# EAGLE design lpcCNC (EAGLE 8.3.1)

## Sheet 1 of 4
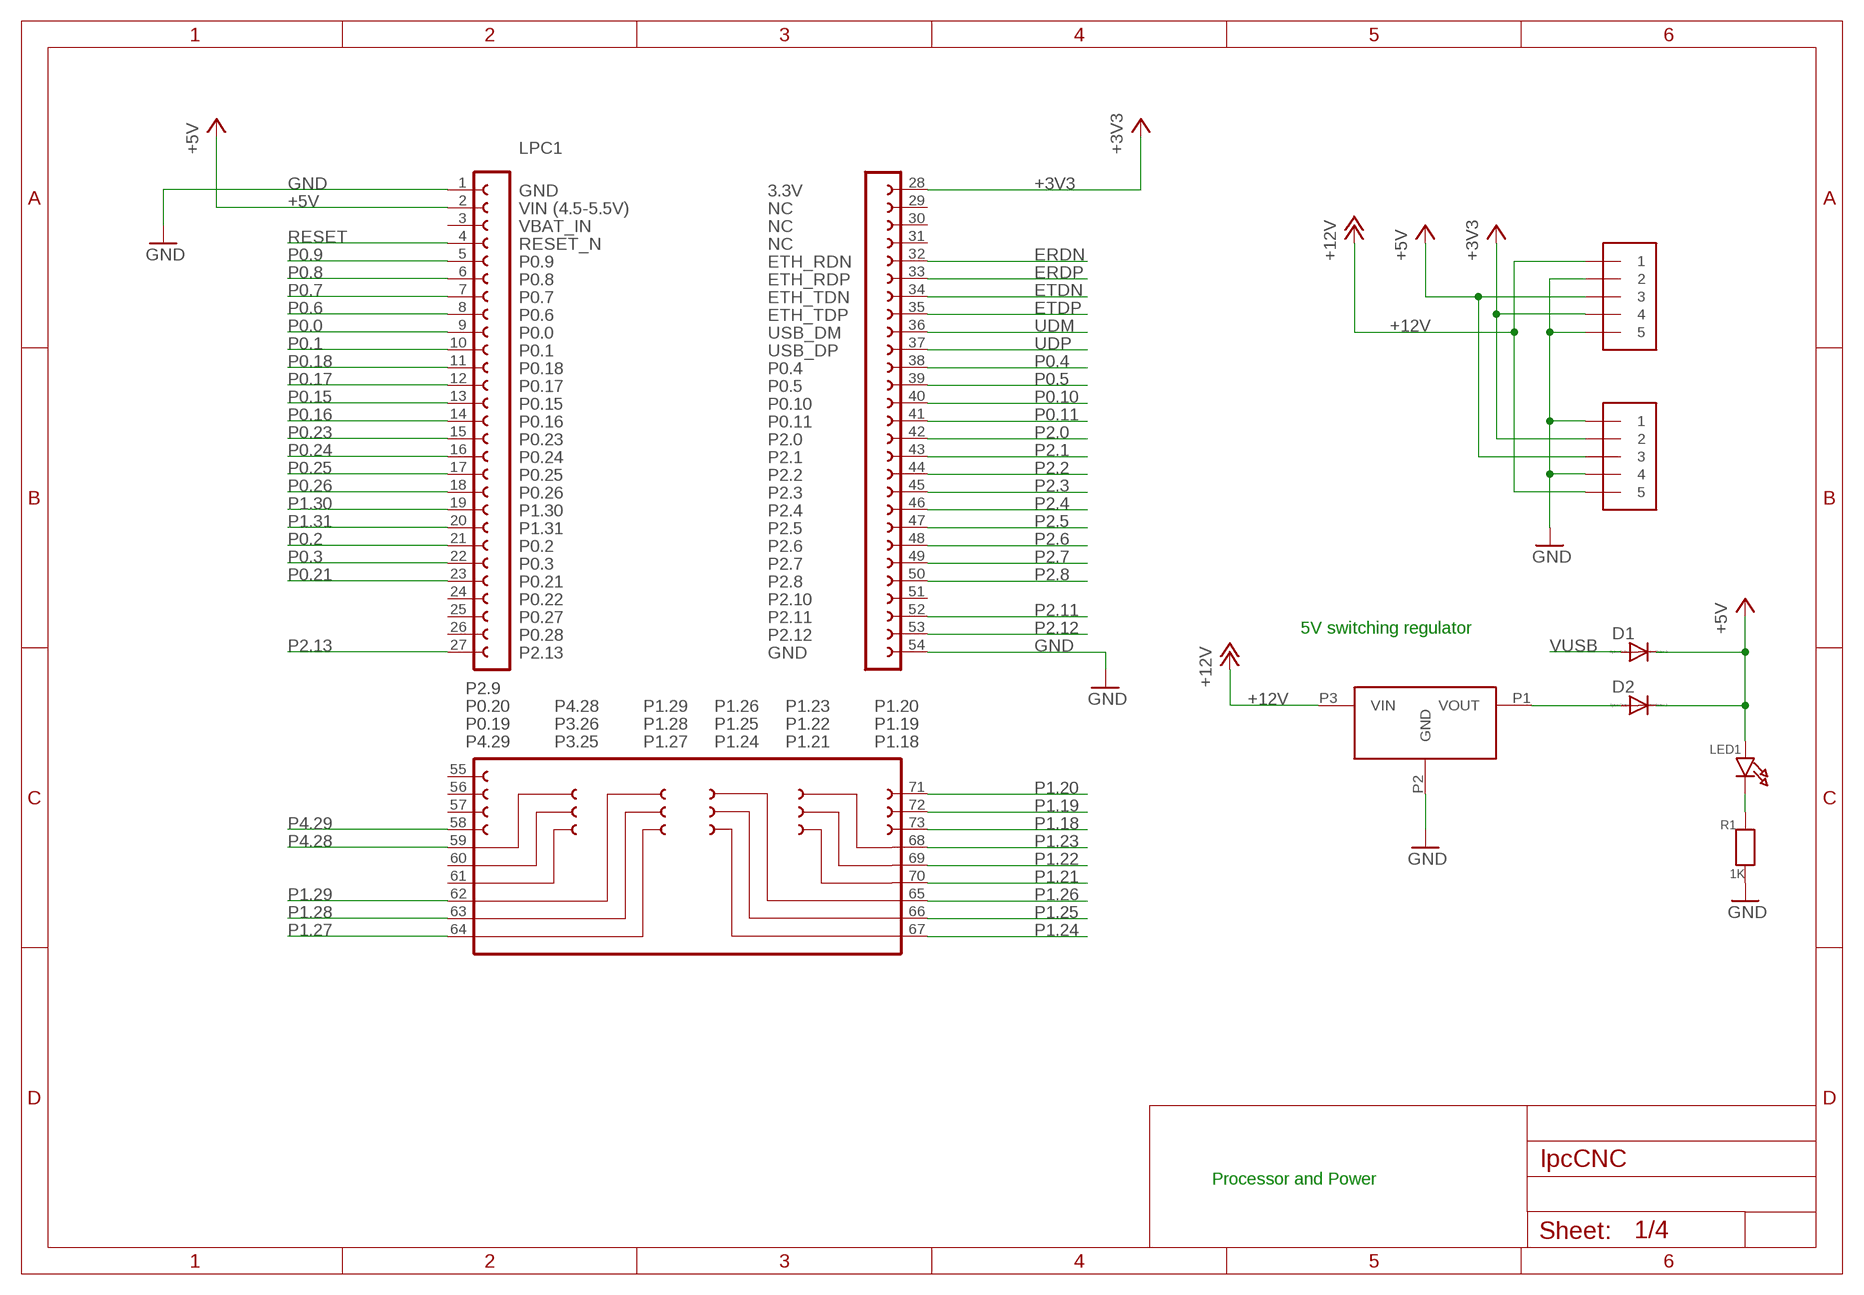
[diagram p0: schematic, sheet 1]

### Parts
D1  DIODE-DO-214AC  [DO-214AC]
D2  DIODE-DO-214AC  [DO-214AC]
J1  1X5  [1X05-3.5MM]
J2  1X5  [1X05-3.5MM]
LED1  LED0603  [CHIPLED_0603]
LPC1  LPCXPRESSO_LPC1769  [LPCXPRESSO_LPC1769]
R1  1K  RESISTOR0603  [0603]
VR1  78SR  [78SR]

### Nets
+3V3: J1.4 J2.2 LPC1.28 ; also sheet 2,3,4
+5V: D1.C D2.C J1.3 J2.3 LED1.A LPC1.2 ; also sheet 2,3,4
+12V: J1.1 J2.5 VR1.P3(VIN) ; also sheet 3
ERDN: LPC1.32 ; also sheet 2
ERDP: LPC1.33 ; also sheet 2
ETDN: LPC1.34 ; also sheet 2
ETDP: LPC1.35 ; also sheet 2
GND: J1.2 J1.5 J2.1 J2.4 LPC1.1 LPC1.54 R1.1 VR1.P2(GND) ; also sheet 2,3,4
N$1: D2.A VR1.P1(VOUT)
N$6: LED1.C R1.2
P0.0: LPC1.9 ; also sheet 4
P0.1: LPC1.10 ; also sheet 4
P0.2: LPC1.21 ; also sheet 2
P0.3: LPC1.22 ; also sheet 2
P0.4: LPC1.38 ; also sheet 3
P0.5: LPC1.39 ; also sheet 3
P0.6: LPC1.8 ; also sheet 2
P0.7: LPC1.7 ; also sheet 2
P0.8: LPC1.6 ; also sheet 2
P0.9: LPC1.5 ; also sheet 2
P0.10: LPC1.40 ; also sheet 3
P0.11: LPC1.41 ; also sheet 3
P0.15: LPC1.13 ; also sheet 2
P0.16: LPC1.14 ; also sheet 2
P0.17: LPC1.12 ; also sheet 2
P0.18: LPC1.11 ; also sheet 2
P0.21: LPC1.23 ; also sheet 4
P0.23: LPC1.15 ; also sheet 4
P0.24: LPC1.16 ; also sheet 4
P0.25: LPC1.17 ; also sheet 4
P0.26: LPC1.18 ; also sheet 4
P1.18: LPC1.73 ; also sheet 2
P1.19: LPC1.72 ; also sheet 2
P1.20: LPC1.71 ; also sheet 2
P1.21: LPC1.70 ; also sheet 2
P1.22: LPC1.69 ; also sheet 2
P1.23: LPC1.68 ; also sheet 3
P1.24: LPC1.67 ; also sheet 3
P1.25: LPC1.66 ; also sheet 3
P1.26: LPC1.65 ; also sheet 3
P1.27: LPC1.64 ; also sheet 2
P1.28: LPC1.63 ; also sheet 3
P1.29: LPC1.62 ; also sheet 3
P1.30: LPC1.19 ; also sheet 2
P1.31: LPC1.20 ; also sheet 3
P2.0: LPC1.42 ; also sheet 3
P2.1: LPC1.43 ; also sheet 3
P2.2: LPC1.44 ; also sheet 3
P2.3: LPC1.45 ; also sheet 3
P2.4: LPC1.46 ; also sheet 3
P2.5: LPC1.47 ; also sheet 3
P2.6: LPC1.48 ; also sheet 3
P2.7: LPC1.49 ; also sheet 3
P2.8: LPC1.50 ; also sheet 3
P2.11: LPC1.52 ; also sheet 3
P2.12: LPC1.53 ; also sheet 2
P2.13: LPC1.27 ; also sheet 3
P4.28: LPC1.59 ; also sheet 2
P4.29: LPC1.58 ; also sheet 2
RESET: LPC1.4 ; also sheet 2
UDM: LPC1.36 ; also sheet 2
UDP: LPC1.37 ; also sheet 2
VUSB: D1.A ; also sheet 2
Unconnected: LPC1.3 LPC1.24 LPC1.25 LPC1.26 LPC1.29 LPC1.30 LPC1.31 LPC1.51 LPC1.55 LPC1.56 LPC1.57 LPC1.60 LPC1.61

### Notes on the sheet
- 5V switching regulator
- Processor and Power

## Sheet 2 of 4
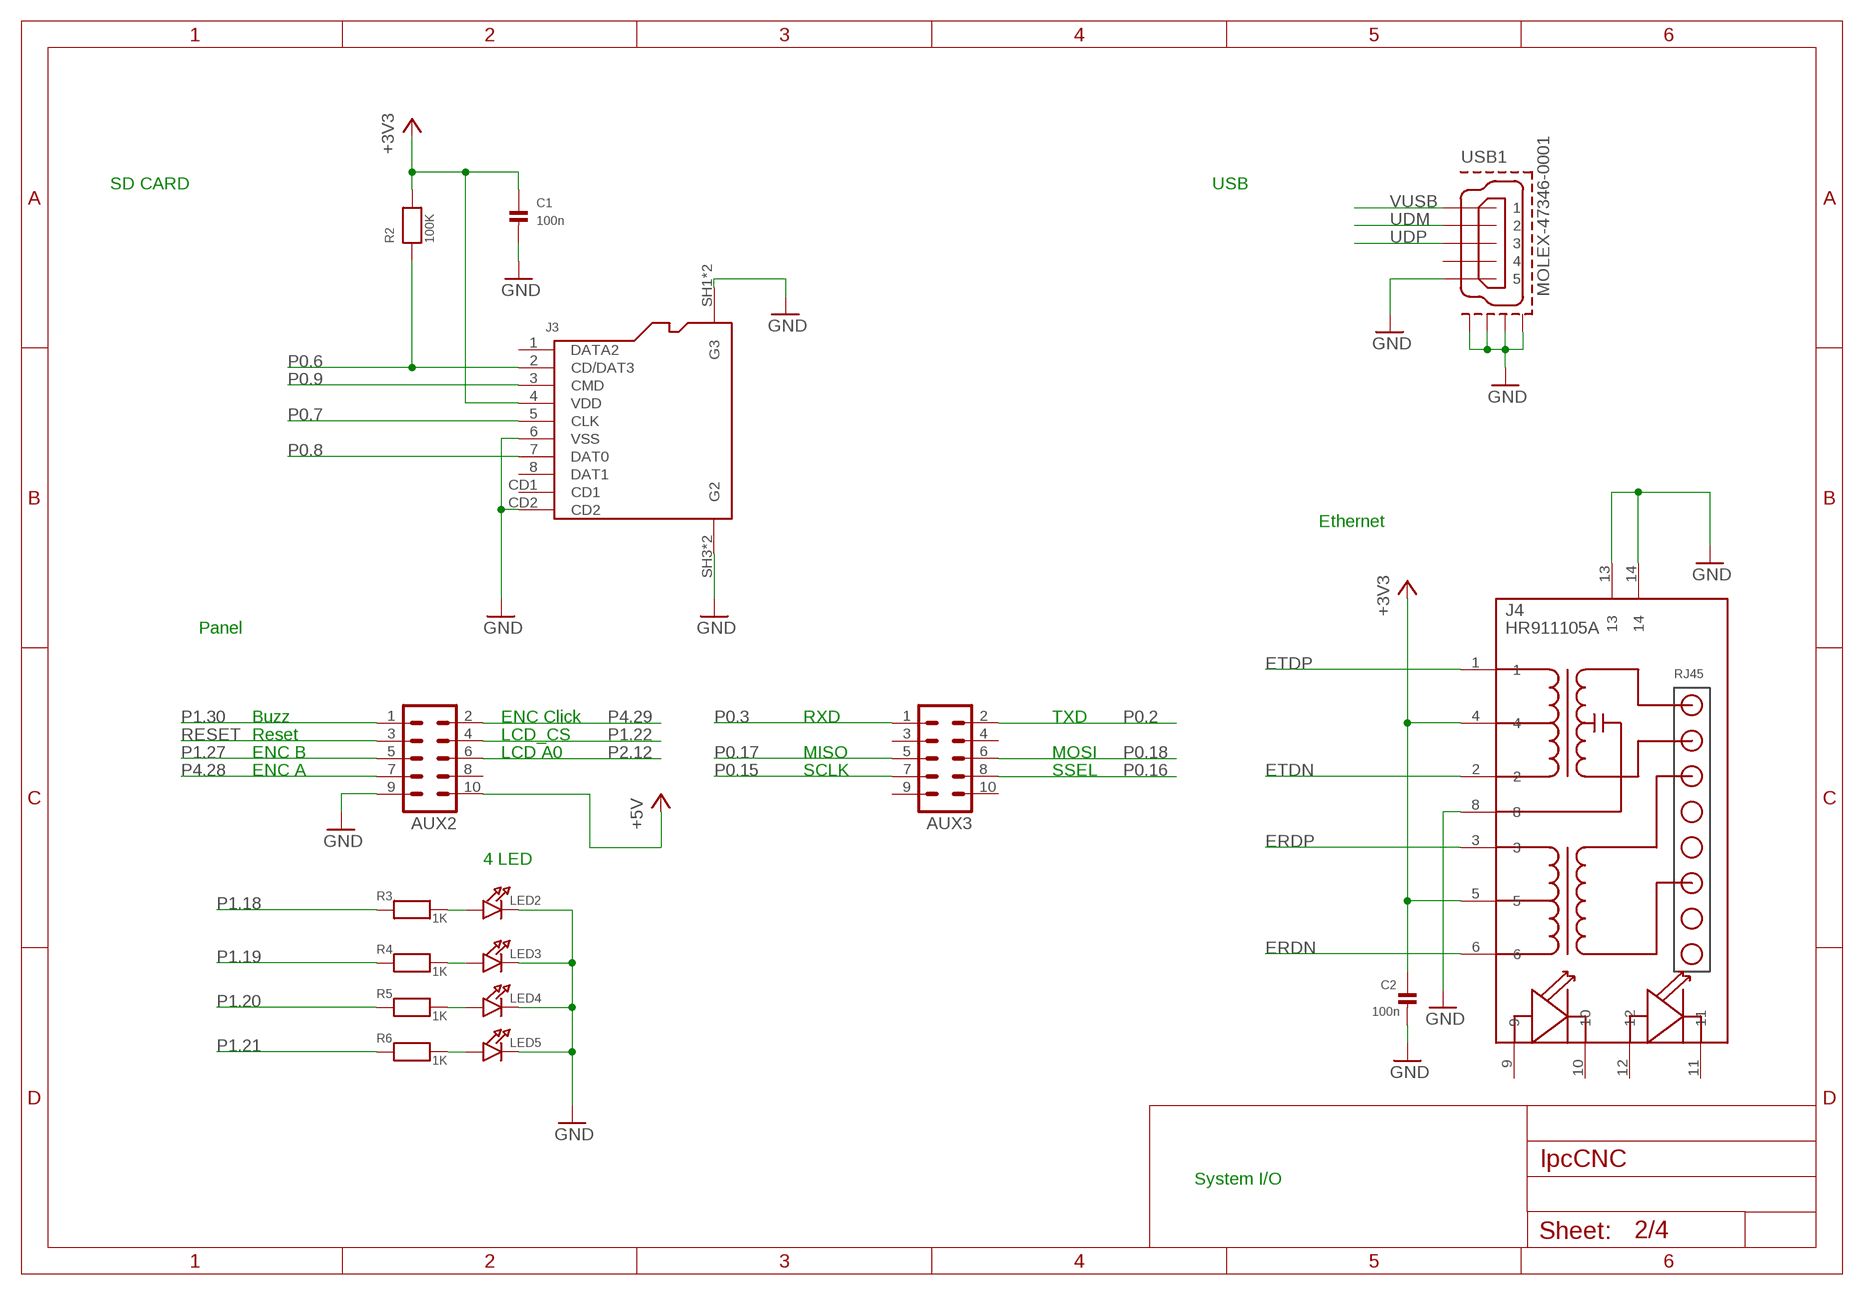
[diagram p1: schematic, sheet 2]

### Parts
AUX2  ML10  [ML10]
AUX3  ML10  [ML10]
C1  100n  CAP_CERAMIC0603  [0603]
C2  100n  CAP_CERAMIC0603  [0603]
J3  AMPHENOL_114-00841-68  [AMPHENOL_114-00841-68]
J4  HR911105A  [HR911105A]
LED2  LED0603  [CHIPLED_0603]
LED3  LED0603  [CHIPLED_0603]
LED4  LED0603  [CHIPLED_0603]
LED5  LED0603  [CHIPLED_0603]
R2  100K  RESISTOR0603  [0603]
R3  1K  RESISTOR0603  [0603]
R4  1K  RESISTOR0603  [0603]
R5  1K  RESISTOR0603  [0603]
R6  1K  RESISTOR0603  [0603]
USB1  MOLEX-47346-0001  [MOLEX-47364-0001]

### Nets
+3V3: C1.1 C2.1 J3.4(VDD) J4.4 J4.5 R2.2 ; also sheet 1,3,4
+5V: AUX2.10 ; also sheet 1,3,4
ERDN: J4.6 ; also sheet 1
ERDP: J4.3 ; also sheet 1
ETDN: J4.2 ; also sheet 1
ETDP: J4.1 ; also sheet 1
GND: AUX2.9 C1.2 C2.2 J3.6(VSS) J3.CD2 J3.SH1(G3) J3.SH2(G3) J3.SH3(G2) J3.SH4(G2) J4.8 J4.13 J4.14 LED2.C LED3.C LED4.C LED5.C USB1.5 USB1.GND1 USB1.GND2 USB1.GND3 USB1.GND4 ; also sheet 1,3,4
N$2: LED2.A R3.2
N$3: LED3.A R4.2
N$4: LED4.A R5.2
N$5: LED5.A R6.2
P0.2: AUX3.2 ; also sheet 1
P0.3: AUX3.1 ; also sheet 1
P0.6: J3.2(CD/DAT3) R2.1 ; also sheet 1
P0.7: J3.5(CLK) ; also sheet 1
P0.8: J3.7(DAT0) ; also sheet 1
P0.9: J3.3(CMD) ; also sheet 1
P0.15: AUX3.7 ; also sheet 1
P0.16: AUX3.8 ; also sheet 1
P0.17: AUX3.5 ; also sheet 1
P0.18: AUX3.6 ; also sheet 1
P1.18: R3.1 ; also sheet 1
P1.19: R4.1 ; also sheet 1
P1.20: R5.1 ; also sheet 1
P1.21: R6.1 ; also sheet 1
P1.22: AUX2.4 ; also sheet 1
P1.27: AUX2.5 ; also sheet 1
P1.30: AUX2.1 ; also sheet 1
P2.12: AUX2.6 ; also sheet 1
P4.28: AUX2.7 ; also sheet 1
P4.29: AUX2.2 ; also sheet 1
RESET: AUX2.3 ; also sheet 1
UDM: USB1.2 ; also sheet 1
UDP: USB1.3 ; also sheet 1
VUSB: USB1.1 ; also sheet 1
Unconnected: AUX2.8 AUX3.3 AUX3.4 AUX3.9 AUX3.10 J3.1(DATA2) J3.8(DAT1) J3.CD1 J4.9 J4.10 J4.11 J4.12 USB1.4

### Notes on the sheet
- SD CARD | USB
- Ethernet
- Panel
- Buzz | ENC Click | RXD | TXD
- Reset | LCD_CS
- ENC B | LCD A0 | MISO | MOSI
- ENC A | SCLK | SSEL
- 4 LED
- System I/O

## Sheet 3 of 4
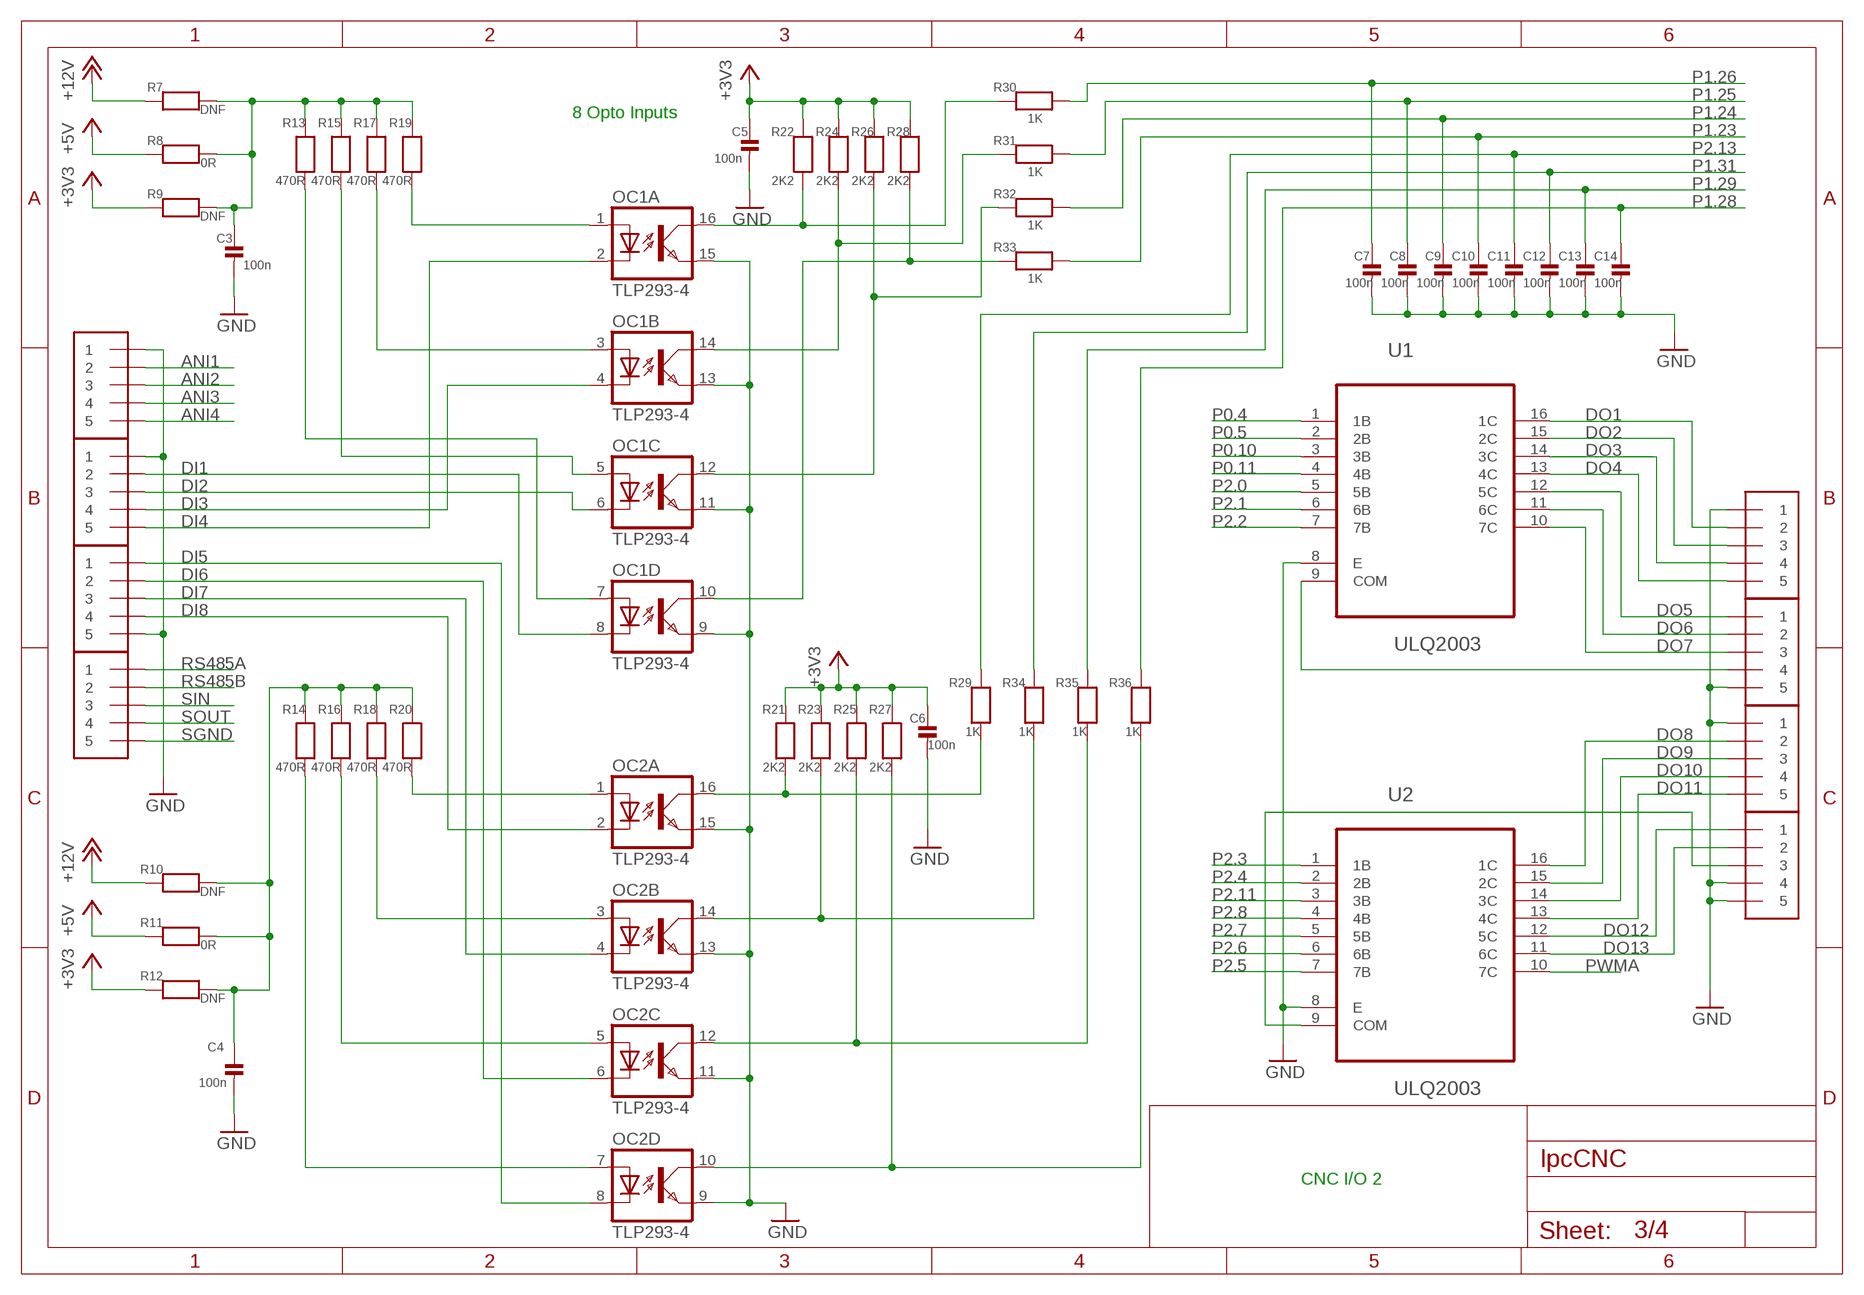
[diagram p2: schematic, sheet 3]

### Parts
C3  100n  CAP_CERAMIC0603  [0603]
C4  100n  CAP_CERAMIC0603  [0603]
C5  100n  CAP_CERAMIC0603  [0603]
C6  100n  CAP_CERAMIC0603  [0603]
C7  100n  CAP_CERAMIC0603  [0603]
C8  100n  CAP_CERAMIC0603  [0603]
C9  100n  CAP_CERAMIC0603  [0603]
C10  100n  CAP_CERAMIC0603  [0603]
C11  100n  CAP_CERAMIC0603  [0603]
C12  100n  CAP_CERAMIC0603  [0603]
C13  100n  CAP_CERAMIC0603  [0603]
C14  100n  CAP_CERAMIC0603  [0603]
J5  1X5  [1X05-3.5MM]
J6  1X5  [1X05-3.5MM]
J7  1X5  [1X05-3.5MM]
J8  1X5  [1X05-3.5MM]
J9  1X5  [1X05-3.5MM]
J10  1X5  [1X05-3.5MM]
J11  1X5  [1X05-3.5MM]
J12  1X5  [1X05-3.5MM]
OC1  TLP293-4  TLP283-4  [MINI-FLAT-16]
OC2  TLP293-4  TLP283-4  [MINI-FLAT-16]
R7  DNF  RESISTOR0603  [0603]
R8  0R  RESISTOR0603  [0603]
R9  DNF  RESISTOR0603  [0603]
R10  DNF  RESISTOR0603  [0603]
R11  0R  RESISTOR0603  [0603]
R12  DNF  RESISTOR0603  [0603]
R13  470R  RESISTOR0603  [0603]
R14  470R  RESISTOR0603  [0603]
R15  470R  RESISTOR0603  [0603]
R16  470R  RESISTOR0603  [0603]
R17  470R  RESISTOR0603  [0603]
R18  470R  RESISTOR0603  [0603]
R19  470R  RESISTOR0603  [0603]
R20  470R  RESISTOR0603  [0603]
R21  2K2  RESISTOR0603  [0603]
R22  2K2  RESISTOR0603  [0603]
R23  2K2  RESISTOR0603  [0603]
R24  2K2  RESISTOR0603  [0603]
R25  2K2  RESISTOR0603  [0603]
R26  2K2  RESISTOR0603  [0603]
R27  2K2  RESISTOR0603  [0603]
R28  2K2  RESISTOR0603  [0603]
R29  1K  RESISTOR0603  [0603]
R30  1K  RESISTOR0603  [0603]
R31  1K  RESISTOR0603  [0603]
R32  1K  RESISTOR0603  [0603]
R33  1K  RESISTOR0603  [0603]
R34  1K  RESISTOR0603  [0603]
R35  1K  RESISTOR0603  [0603]
R36  1K  RESISTOR0603  [0603]
U1  ULQ2003  ULN2003ADE4  [SOIC127P600X175-16N]
U2  ULQ2003  ULN2003ADE4  [SOIC127P600X175-16N]

### Nets
+3V3: C5.1 C6.1 R9.2 R12.2 R21.2 R22.2 R23.2 R24.2 R25.2 R26.2 R27.2 R28.2 ; also sheet 1,2,4
+5V: R8.2 R11.2 ; also sheet 1,2,4
+12V: R7.2 R10.2 ; also sheet 1
ANI1: J5.2 ; also sheet 4
ANI2: J5.3 ; also sheet 4
ANI3: J5.4 ; also sheet 4
ANI4: J5.5 ; also sheet 4
DI1: J6.2 OC1.8(D:C)
DI2: J6.3 OC1.6(C:C)
DI3: J6.4 OC1.4(B:C)
DI4: J6.5 OC1.2(A:C)
DI5: J7.1 OC2.8(D:C)
DI6: J7.2 OC2.6(C:C)
DI7: J7.3 OC2.4(B:C)
DI8: J7.4 OC2.2(A:C)
DO1: J9.2 U1.16(1C)
DO2: J9.3 U1.15(2C)
DO3: J9.4 U1.14(3C)
DO4: J9.5 U1.13(4C)
DO5: J10.1 U1.12(5C)
DO6: J10.2 U1.11(6C)
DO7: J10.3 U1.10(7C)
DO8: J11.2 U2.16(1C)
DO9: J11.3 U2.15(2C)
DO10: J11.4 U2.14(3C)
DO11: J11.5 U2.13(4C)
DO12: J12.1 U2.12(5C)
DO13: J12.2 U2.11(6C)
GND: C3.2 C4.2 C5.2 C6.2 C7.2 C8.2 C9.2 C10.2 C11.2 C12.2 C13.2 C14.2 J5.1 J6.1 J7.5 J9.1 J10.5 J11.1 J12.4 J12.5 OC1.9(D:EMIT) OC1.11(C:EMIT) OC1.13(B:EMIT) OC1.15(A:EMIT) OC2.9(D:EMIT) OC2.11(C:EMIT) OC2.13(B:EMIT) OC2.15(A:EMIT) U1.8(E) U2.8(E) ; also sheet 1,2,4
N$9: J10.4 U1.9(COM)
N$13: J12.3 U2.9(COM)
N$15: C3.1 R7.1 R8.1 R9.1 R13.2 R15.2 R17.2 R19.2
N$16: OC2.1(A:A) R20.1
N$31: OC2.3(B:A) R18.1
N$32: OC2.5(C:A) R16.1
N$33: OC2.7(D:A) R14.1
N$38: C4.1 R10.1 R11.1 R12.1 R14.2 R16.2 R18.2 R20.2
N$42: OC1.1(A:A) R19.1
N$43: OC1.3(B:A) R17.1
N$44: OC1.5(C:A) R15.1
N$49: OC1.7(D:A) R13.1
N$66: OC1.16(A:COL) R22.1 R30.2
N$67: OC1.14(B:COL) R24.1 R31.2
N$71: OC2.16(A:COL) R21.1 R29.1
N$72: OC2.14(B:COL) R23.1 R34.1
N$73: OC2.12(C:COL) R25.1 R35.1
N$74: OC2.10(D:COL) R27.1 R36.1
N$75: OC1.12(C:COL) R26.1 R32.2
N$89: OC1.10(D:COL) R28.1 R33.2
P0.4: U1.1(1B) ; also sheet 1
P0.5: U1.2(2B) ; also sheet 1
P0.10: U1.3(3B) ; also sheet 1
P0.11: U1.4(4B) ; also sheet 1
P1.23: C10.1 R33.1 ; also sheet 1
P1.24: C9.1 R32.1 ; also sheet 1
P1.25: C8.1 R31.1 ; also sheet 1
P1.26: C7.1 R30.1 ; also sheet 1
P1.28: C14.1 R36.2 ; also sheet 1
P1.29: C13.1 R35.2 ; also sheet 1
P1.31: C12.1 R34.2 ; also sheet 1
P2.0: U1.5(5B) ; also sheet 1
P2.1: U1.6(6B) ; also sheet 1
P2.2: U1.7(7B) ; also sheet 1
P2.3: U2.1(1B) ; also sheet 1
P2.4: U2.2(2B) ; also sheet 1
P2.5: U2.7(7B) ; also sheet 1
P2.6: U2.6(6B) ; also sheet 1
P2.7: U2.5(5B) ; also sheet 1
P2.8: U2.4(4B) ; also sheet 1
P2.11: U2.3(3B) ; also sheet 1
P2.13: C11.1 R29.2 ; also sheet 1
PWMA: U2.10(7C) ; also sheet 4
RS485A: J8.1 ; also sheet 4
RS485B: J8.2 ; also sheet 4
SGND: J8.5 ; also sheet 4
SIN: J8.3 ; also sheet 4
SOUT: J8.4 ; also sheet 4

### Notes on the sheet
- 8 Opto Inputs
- CNC I/O 2

## Sheet 4 of 4
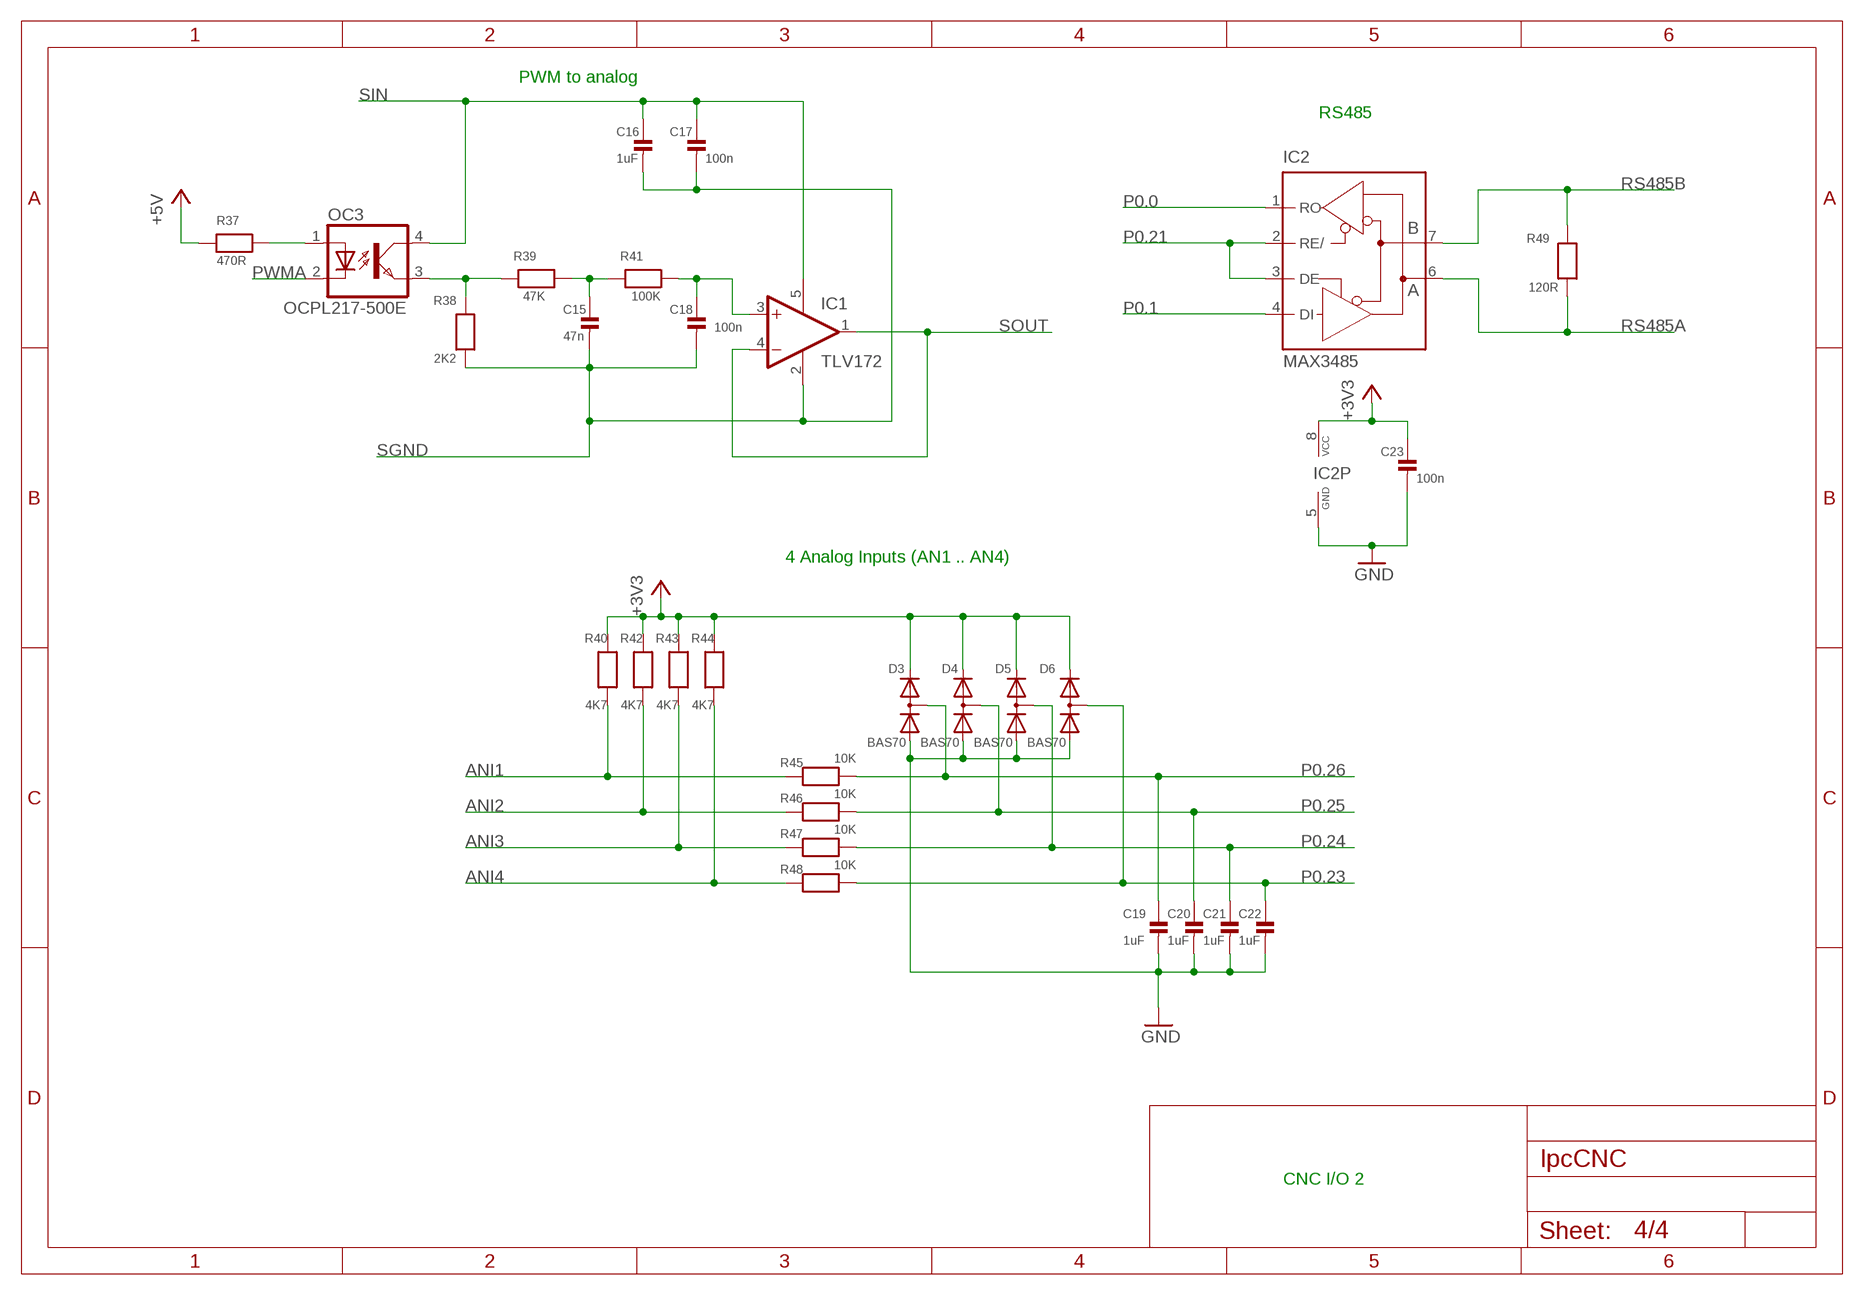
[diagram p3: schematic, sheet 4]

### Parts
C15  47n  CAP_CERAMIC0603  [0603]
C16  1uF  CAP_CERAMIC0603  [0603]
C17  100n  CAP_CERAMIC0603  [0603]
C18  100n  CAP_CERAMIC0603  [0603]
C19  1uF  CAP_CERAMIC0603  [0603]
C20  1uF  CAP_CERAMIC0603  [0603]
C21  1uF  CAP_CERAMIC0603  [0603]
C22  1uF  CAP_CERAMIC0603  [0603]
C23  100n  CAP_CERAMIC0603  [0603]
D3  BAS70  DIODE_2CACA-SOT23  [SOT23]
D4  BAS70  DIODE_2CACA-SOT23  [SOT23]
D5  BAS70  DIODE_2CACA-SOT23  [SOT23]
D6  BAS70  DIODE_2CACA-SOT23  [SOT23]
IC1  TLV172  TLV172MF  [SOT23-5]
IC2  MAX3485  MAX481CSA  [SO08]
OC3  OCPL217-500E  TLP283  [MINI-FLAT-4]
R37  470R  RESISTOR0603  [0603]
R38  2K2  RESISTOR0603  [0603]
R39  47K  RESISTOR0603  [0603]
R40  4K7  RESISTOR0603  [0603]
R41  100K  RESISTOR0603  [0603]
R42  4K7  RESISTOR0603  [0603]
R43  4K7  RESISTOR0603  [0603]
R44  4K7  RESISTOR0603  [0603]
R45  10K  RESISTOR0603  [0603]
R46  10K  RESISTOR0603  [0603]
R47  10K  RESISTOR0603  [0603]
R48  10K  RESISTOR0603  [0603]
R49  120R  RESISTOR0603  [0603]

### Nets
+3V3: C23.1 D3.2(C) D4.2(C) D5.2(C) D6.2(C) IC2.8(VCC) R40.2 R42.2 R43.2 R44.2 ; also sheet 1,2,3
+5V: R37.1 ; also sheet 1,2,3
ANI1: R40.1 R45.2 ; also sheet 3
ANI2: R42.1 R46.2 ; also sheet 3
ANI3: R43.1 R47.2 ; also sheet 3
ANI4: R44.1 R48.2 ; also sheet 3
GND: C19.2 C20.2 C21.2 C22.2 C23.2 D3.1(A) D4.1(A) D5.1(A) D6.1(A) IC2.5(GND) ; also sheet 1,2,3
N$85: OC3.1(A) R37.2
N$86: OC3.3(EMIT) R38.2 R39.2
N$87: C15.1 R39.1 R41.2
N$88: C18.1 IC1.3(+IN) R41.1
P0.0: IC2.1(RO) ; also sheet 1
P0.1: IC2.4(DI) ; also sheet 1
P0.21: IC2.2(RE/) IC2.3(DE) ; also sheet 1
P0.23: C22.1 D6.3(AC) R48.1 ; also sheet 1
P0.24: C21.1 D5.3(AC) R47.1 ; also sheet 1
P0.25: C20.1 D4.3(AC) R46.1 ; also sheet 1
P0.26: C19.1 D3.3(AC) R45.1 ; also sheet 1
PWMA: OC3.2(C) ; also sheet 3
RS485A: IC2.6(A) R49.1 ; also sheet 3
RS485B: IC2.7(B) R49.2 ; also sheet 3
SGND: C15.2 C16.2 C17.2 C18.2 IC1.2(V-) R38.1 ; also sheet 3
SIN: C16.1 C17.1 IC1.5(V+) OC3.4(COL) ; also sheet 3
SOUT: IC1.1(OUT) IC1.4(-IN) ; also sheet 3

### Notes on the sheet
- PWM to analog
- RS485
- 4 Analog Inputs (AN1 .. AN4)
- CNC I/O 2

## Library data of the parts
AUX2 AUX3 = con-ml:ML10: HARTING; OC_FARNELL: unknown; OC_NEWARK: unknown
C1-C23 = microbuilder:CAP_CERAMIC: Ceramic Capacitors 0402 - 0402 Surface Mount Capacitors 0.1uF 10V 10% [Digikey: 490-1318-2-ND] 0603 - 0603 Surface Mount Capacitors 16 pF 50V 5% [Digikey: 445-5051-2-ND] 22 pF 50V [Digikey: PCC220ACVTR-ND] 33 pF 50V 5% [Digikey: 490-1415-1-ND] 56pF 50V 5% [Digikey: 490-1421-1-ND] 220pF 50V 5% [Digikey: 445-1285-1-ND] 680 pF 50V 2200 pF 50V 5% C0G [Digikey: 445-1297-1-ND] 5600 pF 100V 5% X7R [Digikey: 478-3711-1-ND] 0.1 µF 25V 10% [Digikey: PCC2277TR-ND] 0.22 µF 16V 10% X7R [Digikey: 445-1318-1-ND] 1.0 µF 25V 10% [Digikey: 445-5146-2-ND] 0603 - RF Specific 3pF 250V +/-0.1pF RF [Digikey: 712-1347-1-ND] 18 pF 250V 5% [Digikey: 478-3505-1-ND or 712-1322-1-ND] 56 pF 250V 5% C0G RF [Digikey: 490-4867-1-ND] 68 pF 250V RF [Digikey: 490-4868-1-ND] 0805 - 0805 Surface Mount Capacitors 220 pF 250V 2% RF Ceramic Capacitor [Digikey: 712-1398-1-ND] 1000 pF 50V 2% NP0 Ceramic Capacitor [Digikey: 478-3760-1-ND] 0.1 µF 25V 10% Ceramic Capacitor [Digikey: PCC1828TR-ND] 1.0 µF 16V 10% Ceramic Capacitor[Digikey: 490-1691-2-ND] 10.0 µF 10V 10% Ceramic Capacitor[Digikey: 709-1228-1-ND] 1206 - 1206 Surface Mount Capacitors
D1 D2 = diode:DIODE-: DIODE
D3-D6 = diode:DIODE_2CACA-: 2 Diodes - Cathode-Anode|Cathode-Anode
IC1 = CNClib:TLV172: Low Power Single Op Amp Source: http://cache.national.com/ds/LM/LM321.pdf
IC2 = maxim:MAX481CSA: RS485 TRANSEIVER; MF: MAXIM; MPN: MAX481CSA; OC_FARNELL: unknown; OC_NEWARK: 90C3817
J1 J2 J5-J12 = adafruit:1X5
J3 = CNClib:AMPHENOL_114-00841-68
J4 = CNClib:HR911105A
LED1-LED5 = microbuilder:LED: LED 0603 - 0603 Surface Mount Package Green LED - Low Power (3.9mcd, 2ma, 1.7Vf) Orange LED - Low Power (9.8mcd, 2ma, 1.8Vf) Red LED - Low Power (5mcd, 2ma, 1.8Vf) Yellow LED - Low Power (7mcd, 2ma, 1.8Vf) 0805 - 0805 Surface Mount Package 20mA: Red LED (104mcd, 20mA, Diffused) - LS R976 [Digikey: 475-1278-6-ND] Red LED (12mcd, 20mA, 2.0Vf, Clear) - APT2012EC [Digikey: 754-1128-1-ND] Green LED (15mcd, 20mA, 2.2Vf, Clear) - APT2012GC [Digikey: 754-1131-1-ND] Orange LED (160mcd, 20mA, 2.1Vf, Clear) - APT2012SECK [Digikey: 754-1130-1-ND] 2mA: Red LED (8.8mcd, 2mA, 1.8Vf, Clear) - Low Power [Digikey: 475-2510-1-ND] Green LED (5mcd, 2mA, 1.8Vf, Clear) - Low Power [Digikey: 475-2730-1-ND] Yellow LED (11.3mcd, 2mA, 1.8Vf, Clear) - Low Power [Digikey: 475-2555-1-ND] 1206 - 1206 Surface Mount Package Green LED (26mcd, 20mA, Diffused) - LG N971 [Digikey: 475-1407-6-ND] Red LED (15mcd, 20mA, Diffused) - LH N974 [Digikey: 475-1416-6-ND]
LPC1 = CNClib:LPCXPRESSO_LPC1769
OC1 OC2 = optocoupler:TLP283-4: TOSHIBA PHOTOCOUPLER GaAs IRED & PHOTO-TRANSISTOR Source: http://www.semicon.toshiba.co.jp/td/en/Opto/Photocoupler/en_20050928_TLP283_datasheet.pdf; OC_FARNELL: unknown; OC_NEWARK: unknown
OC3 = optocoupler:TLP283: TOSHIBA PHOTOCOUPLER GaAs IRED & PHOTO-TRANSISTOR Source: http://www.semicon.toshiba.co.jp/td/en/Opto/Photocoupler/en_20050928_TLP283_datasheet.pdf; OC_FARNELL: unknown; OC_NEWARK: unknown
R1-R49 = microbuilder:RESISTOR: Resistors 0402 - 0402 Surface Mount Package 10.0K 1% 1/16W [Digikey: 311-10.0KLRTR-ND] 0603 - 0603 Surface Mount Package 0 Ohm 1/10 Watt 1% Resistor 15 Ohm 1/10 Watt 1% Resistor 33 Ohm 1/10 Watt 1% Resistor 49.9 Ohm 1/10 Watt 1% Resistor 100 Ohm 1/10 Watt 1% Resistor 150 Ohm 1/10 Watt 1% Resistor 240 Ohm 1/10 Watt 1% Resistor 390 Ohm 1/10 Watt 1% Resistor 560 Ohm 1/10 Watt 1% Resistor 750 Ohm 1/10 Watt 1% Resistor 1.0K Ohm 1/10 Watt 1% Resistor 1.5K Ohm 1/10 Watt 1% Resistor 2.0K Ohm 1/10 Watt 1% Resistor 4.7K Ohm 1/10 Watt 1% Resistor 10.0K Ohm 1/10 Watt 1% Resistor 20.0K Ohm 1/10 Watt 1% Resistor 33.0K Ohm 1/10 Watt 1% Resistor 100.0K Ohm 1/10 Watt 1% Resistor 0805 - 0805 Surface Mount Package 0 Ohm 1/8 Watt 1% Resistor 33 Ohm 1/8 Watt 1% Resistor 100 Ohm 1/8 Watt 1% Resistor 150 Ohm 1/8 Watt 1% Resistor 200 Ohm 1/8 Watt 1% Resistor 240 Ohm 1/8 Watt 1% Resistor 330 Ohm 1/8 Watt 1% Resistor 390 Ohm 1/8 Watt 1% Resistor 470 Ohm 1/8 Watt 1% Resistor 1.0K Ohm 1/8 Watt 1% Resistor 1.5K Ohm 1/8 Watt 1% Resistor 2.0K Ohm 1/8 Watt 1% Resistor 4.7K Ohm 1/8 Watt 1% Resistor 5.1K Ohm 1/8 Watt 1% Resistor 5.6K Ohm 1/8 Watt 1% Resistor 10.0K Ohm 1/8 Watt 1% Resistor 22.0K Ohm 1/8 Watt 1% Resistor 33.0K Ohm 1/8 Watt 1% Resistor 100K Ohm 1/8 Watt 1% Resistor 1206 - 1206 Surface Mount Package
U1 U2 = Texas Instruments_By_element14_Batch_1:ULN2003ADE4: DARLINGTON TRANSISTOR ARRAYS; MPN: ULN2003ADE4; OC_FARNELL: 1125398; OC_NEWARK: 93K1078; PACKAGE: SOIC-16; SUPPLIER: Texas Instruments
USB1 = usb_con-update:MOLEX-47346-0001: MICRO USB B, BOTTOM MOUNT
VR1 = CNClib:78SR

## Board
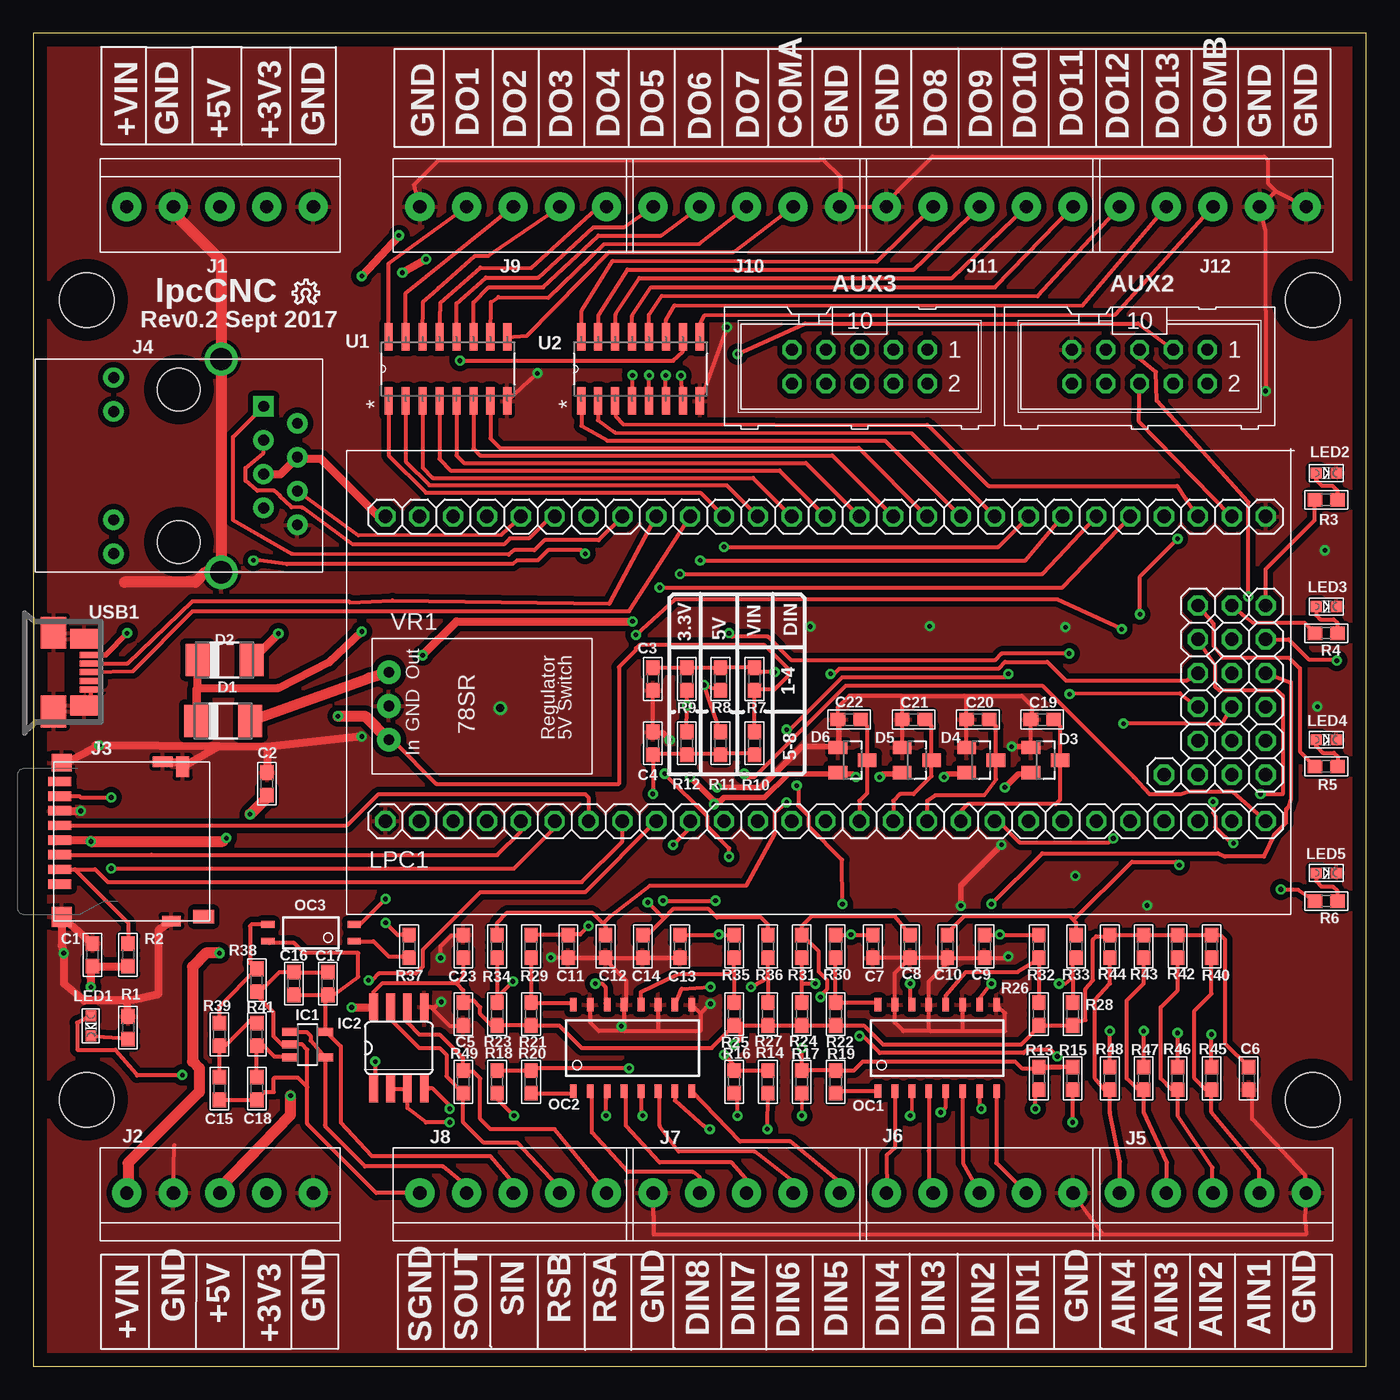
[diagram p4: board, top side]
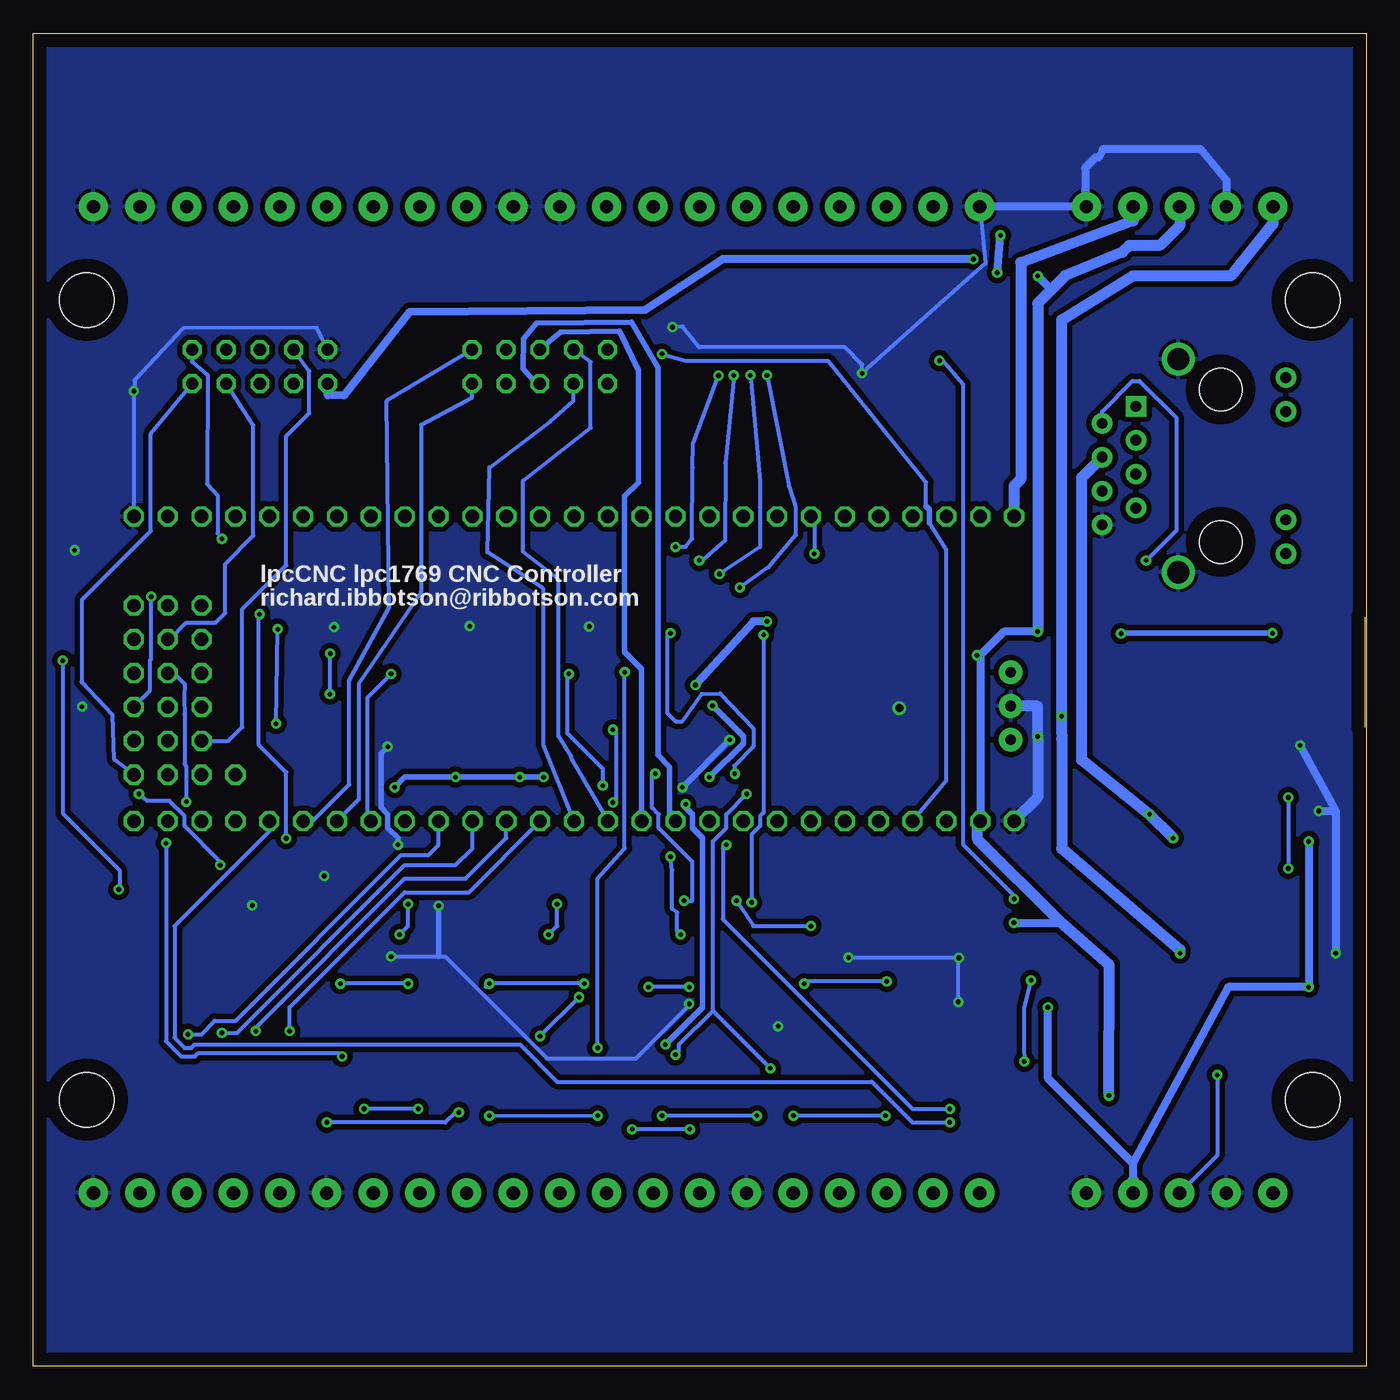
[diagram p5: board, bottom side, seen from below]

Size 100 x 100 mm. Coordinates in mm from the lower left corner, seen from the top.
Outline: 0,0 100,0 100,100 0,100 0,0
Copper layers (1*16): Top 0.035mm / dielectric 1.5mm / Bottom 0.035mm
Design rules "pcbway": minimum track width 6mil, minimum drill 0.3mm, track to track 0.205mm, track to pad 0.205mm, pad to pad 0.205mm, via to via 0.205mm, smd to smd 8mil, copper to edge 40mil, drill to drill 8mil, minimum pad ring 10mil, minimum via ring 8mil, stop-mask expansion 4mil, vias tented up to drill 25mil, thermal gap 10mil
Holes 4.1 mm at 4,20 96,20 96,80 4,80

### Footprints (pad centres in the part's own frame; a part is rotated, then mirrored left to right if it is on the bottom)
ML10 = drill 0.914 octagon: 1 -5.08,-1.27; 2 -5.08,1.27; 3 -2.54,-1.27; 4 -2.54,1.27; 5 0,-1.27; 6 0,1.27; 7 2.54,-1.27; 8 2.54,1.27; 9 5.08,-1.27; 10 5.08,1.27
0603 = smd 1.1 x 1: 1 -0.85,0; 2 0.85,0
DO-214AC = smd 1.8 x 2.4: A 2.025,0; C -2.025,0
SOT23 = smd 1 x 1.4: 1 -0.95,-1.1; 2 0.95,-1.1; 3 0,1.1
SOT23-5 = smd 0.6 x 1.2: 1 -0.95,-1.306; 2 0,-1.306; 3 0.95,-1.306; 4 0.95,1.306; 5 -0.95,1.306
SO08 = smd 0.66 x 2.032: 1 -1.905,-3.073; 2 -0.635,-3.073; 3 0.635,-3.073; 4 1.905,-3.073; 5 1.905,3.073; 6 0.635,3.073; 7 -0.635,3.073; 8 -1.905,3.073
1X05-3.5MM = drill 1 pad 2.184: 1 7,0; 2 3.5,0; 3 0,0; 4 -3.5,0; 5 -7,0
AMPHENOL_114-00841-68 = smd 0.7 x 1.75: 1 3.2,-5.888; 2 2.1,-5.888; 3 1,-5.888; 4 -0.1,-5.888; 5 -1.2,-5.888; 6 -2.3,-5.888; 7 -3.4,-5.888; 8 -4.5,-5.888 | smd 1 x 1.55: CD1 5.65,4.912 | smd 1.55 x 1: CD2 -5.602,3.337 | smd 1.3 x 1.5: SH1 -5.9,-5.76 | smd 1.5 x 1.5: SH2 5.65,-5.76 | smd 0.8 x 1.4: SH3 5.975,2.487 | smd 0.8 x 1.5: SH4 -5.975,1.837
HR911105A = drill 0.813 pad 1.524 square: 1 4.445,-6.35 | drill 0.813 pad 1.524: 2 3.175,-8.89; 3 1.905,-6.35; 4 0.635,-8.89; 5 -0.635,-6.35; 6 -1.905,-8.89; 7 -3.175,-6.35; 8 -4.445,-8.89; 9 6.604,4.902; 10 4.064,4.902; 11 -4.064,4.902; 12 -6.604,4.902 | drill 1.651 pad 2.159: 13 8.001,-3.175; 14 -8.001,-3.175 | hole 3.2: 5.715,0; -5.715,0
CHIPLED_0603 = smd 0.8 x 0.8: A 0,-0.75; C 0,0.75
LPCXPRESSO_LPC1769 = drill 1 octagon: 1 -0.635,-10.795; 2 1.905,-10.795; 3 4.445,-10.795; 4 6.985,-10.795; 5 9.525,-10.795; 6 12.065,-10.795; 7 14.605,-10.795; 8 17.145,-10.795; 9 19.685,-10.795; 10 22.225,-10.795; 11 24.765,-10.795; 12 27.305,-10.795; 13 29.845,-10.795; 14 32.385,-10.795; 15 34.925,-10.795; 16 37.465,-10.795; 17 40.005,-10.795; 18 42.545,-10.795; 19 45.085,-10.795; 20 47.625,-10.795; 21 50.165,-10.795; 22 52.705,-10.795; 23 55.245,-10.795; 24 57.785,-10.795; 25 60.325,-10.795; 26 62.865,-10.795; 27 65.405,-10.795; 28 -0.635,12.065; 29 1.905,12.065; 30 4.445,12.065; 31 6.985,12.065; 32 9.525,12.065; 33 12.065,12.065; 34 14.605,12.065; 35 17.145,12.065; 36 19.685,12.065; 37 22.225,12.065; 38 24.765,12.065; 39 27.305,12.065; 40 29.845,12.065; 41 32.385,12.065; 42 34.925,12.065; 43 37.465,12.065; 44 40.005,12.065; 45 42.545,12.065; 46 45.085,12.065; 47 47.625,12.065; 48 50.165,12.065; 49 52.705,12.065; 50 55.245,12.065; 51 57.785,12.065; 52 60.325,12.065; 53 62.865,12.065; 54 65.405,12.065; 55 57.785,-7.315; 56 60.325,-7.315; 57 62.865,-7.315; 58 65.405,-7.315; 59 60.325,-4.775; 60 62.865,-4.775; 61 65.405,-4.775; 62 60.325,-2.235; 63 62.865,-2.235; 64 65.405,-2.235; 65 60.325,0.305; 66 62.865,0.305; 67 65.405,0.305; 68 60.325,2.845; 69 62.865,2.845; 70 65.405,2.845; 71 60.325,5.385; 72 62.865,5.385; 73 65.405,5.385
MINI-FLAT-16 = smd 1 x 0.5: 1 -3.24,4.445; 2 -3.24,3.175; 3 -3.24,1.905; 4 -3.24,0.635; 5 -3.24,-0.635; 6 -3.24,-1.905; 7 -3.24,-3.175; 8 -3.24,-4.445; 9 3.24,-4.445; 10 3.24,-3.175; 11 3.24,-1.905; 12 3.24,-0.635; 13 3.24,0.635; 14 3.24,1.905; 15 3.24,3.175; 16 3.24,4.445
MINI-FLAT-4 = smd 1 x 0.5: 1 -3.24,0.635; 2 -3.24,-0.635; 3 3.24,-0.635; 4 3.24,0.635
SOIC127P600X175-16N = smd 2.057 x 0.61: 1 -4.801,8.89; 2 -4.801,7.62; 3 -4.801,6.35; 4 -4.801,5.08; 5 -4.801,3.81; 6 -4.801,2.54; 7 -4.801,1.27; 8 -4.801,0; 9 0,0; 10 0,1.27; 11 0,2.54; 12 0,3.81; 13 0,5.08; 14 0,6.35; 15 0,7.62; 16 0,8.89
MOLEX-47364-0001 = smd 1.7 x 0.45: 1 2.8,1.3; 2 2.8,0.65; 3 2.8,0; 4 2.8,-0.65; 5 2.8,-1.3 | smd 1.9 x 2.375: GND1 0,2.95; GND4 0,-2.95 | smd 2.1 x 1.475: GND2 2.3,2.5; GND3 2.3,-2.5
78SR = drill 0.8 pad 1.778: P1 -2.54,0; P2 0,0; P3 2.54,0

### Placement (x,y rotation side)
AUX2  83,75 180 top
AUX3  62,75 180 top
C1  4.45,30.86 90 top
C2  17.53,43.69 90 top
C3  46.48,51.56 270 top
C4  46.48,46.74 90 top
C5  32.26,26.42 270 top
C6  91.19,21.59 270 top
C7  62.99,31.5 270 top
C8  65.79,31.5 270 top
C9  71.37,31.5 270 top
C10  68.58,31.5 270 top
C11  40.13,31.5 270 top
C12  42.93,31.5 270 top
C13  48.51,31.5 270 top
C14  45.72,31.5 270 top
C15  13.97,20.83 270 top
C16  19.56,28.7 90 top
C17  22.1,28.7 90 top
C18  16.76,20.83 270 top
C19  75.69,48.51 180 top
C20  70.87,48.51 180 top
C21  66.04,48.51 180 top
C22  61.21,48.51 180 top
C23  32.26,31.5 90 top
D1  14.35,52.98 0 top
D2  14.25,48.41 0 top
D3  75.95,45.47 270 top
D4  71.12,45.47 270 top
D5  66.29,45.47 270 top
D6  61.47,45.47 270 top
IC1  20.57,24.13 270 top
IC2  27.43,23.88 0 top
J1  14,87 180 top
J2  14,13 0 top
J3  7.87,39.37 270 top
J4  10.92,67.56 90 top
J5  88.5,13 0 top
J6  71,13 0 top
J7  53.5,13 0 top
J8  36,13 0 top
J9  36,87 180 top
J10  53.5,87 180 top
J11  71,87 180 top
J12  88.5,87 180 top
LED1  4.32,25.53 180 top
LED2  97,67 270 top
LED3  97,57 270 top
LED4  97,47 270 top
LED5  97,37 270 top
LPC1  27.05,51.69 0 top
OC1  67.82,23.88 90 top
OC2  44.96,23.88 90 top
OC3  20.83,32.51 180 top
R1  7.11,25.4 270 top
R2  7.11,30.86 270 top
R3  97,65 0 top
R4  97,55 0 top
R5  97,45 0 top
R6  97,34.9 0 top
R7  54.1,51.56 270 top
R8  51.56,51.56 270 top
R9  49.02,51.56 270 top
R10  54.1,46.74 90 top
R11  51.56,46.74 90 top
R12  49.02,46.74 90 top
R13  75.44,21.59 90 top
R14  55.12,21.34 90 top
R15  77.98,21.59 90 top
R16  52.58,21.34 90 top
R17  57.66,21.34 90 top
R18  34.8,21.34 90 top
R19  60.2,21.34 90 top
R20  37.34,21.34 90 top
R21  37.34,26.42 270 top
R22  60.2,26.42 270 top
R23  34.8,26.42 270 top
R24  57.66,26.42 270 top
R25  52.58,26.42 270 top
R26  75.44,26.42 270 top
R27  55.12,26.42 270 top
R28  77.98,26.42 270 top
R29  37.34,31.5 90 top
R30  60.2,31.5 270 top
R31  57.66,31.5 270 top
R32  75.44,31.5 270 top
R33  78.23,31.5 270 top
R34  34.8,31.5 90 top
R35  52.58,31.5 90 top
R36  55.12,31.5 90 top
R37  28.19,31.5 270 top
R38  16.76,28.96 90 top
R39  13.97,24.89 90 top
R40  88.39,31.5 90 top
R41  16.76,24.89 90 top
R42  85.85,31.5 90 top
R43  83.31,31.5 90 top
R44  80.77,31.5 90 top
R45  88.39,21.59 270 top
R46  85.85,21.59 270 top
R47  83.31,21.59 270 top
R48  80.77,21.59 270 top
R49  32.26,21.34 270 top
U1  35.56,77.22 90 top
U2  50,77.22 90 top
U$1  [OSHW_8X70_NOTEXT]  19.46,79.73 0 top
USB1  1.52,52.07 0 top
VR1  26.67,49.53 270 top

### Tracks (layer width: path | path; a pad name or v marks a point on that pad's centre or on a via)
+3V3  (via drill 0.35)
  Top 0.305: 75.57,25.57 R26.2 | 75.57,25.57 R28.2 77.98,25.79 78.94,25.98 78.94,28.29 79.5,28.96 79.5,32 79.76,32.26 80.68,32.26 R44.2 R43.2 R42.2 R40.2 89.07,32.35 89.41,32 89.41,24.22 C6.1 | 75.57,25.57 74.13,24.13 63.75,24.13 62.32,25.57 R22.2 R24.2 R27.2 53.09,25.57 R25.2 50.89,23.88 41.15,23.88 39.46,25.57 R21.2 R23.2 34.38,25.57 33.53,26.42 33.53,26.92 33.02,27.43 32.42,27.43 | 32.42,27.43 C5.1 | IC2.8 25.53,28.07 26.16,28.7 31.75,28.7 | 31.75,28.7 32.26,28.19 32.26,27.6 32.42,27.43 | C23.1 32.26,29.21 31.75,28.7 | R12.2 v49.05,49.55 R9.2 | D5.2 64.84,44.52 | 14.22,39.37 v14.48,39.62 | 17.53,42.67 C2.1
  Top 0.406: v61.72,44.2 61.47,44.45 60.45,44.45 D6.2 60.2,44.45 56.64,44.45 54.86,42.67 51.82,42.67 51.56,42.42 51.05,42.42 | D5.2 64.77,44.45 63.75,44.45 v63.5,44.2 63.75,44.2 | v68.33,44.2 68.58,44.45 69.85,44.45 D4.2 | v72.9,43.43 73.91,44.45 74.68,44.45 D3.2 | v49.28,44.2 51.05,42.42 | 53.09,25.65 53.09,25.57 53.09,24.64 v52.58,24.13 | 51.05,42.42 v51.05,42.16
  Top 0.61: v23.88,26.92 25.5,26.92 IC2.8 | R2.2 C1.1 4.41,30.01 4.32,29.03 v4.32,28.45 | J3.4 4.22,39.47 v4.32,39.37 | J4.5 18.54,66.93 19.7,68.09 | 19.7,68.09 J4.4 | LPC1.28 25.91,63.75 21.59,68.07 19.72,68.07 19.7,68.09
  Top 0.813: v16.26,41.4 17.53,42.67 | v4.32,39.37 14.22,39.37
  Bottom 0.305: 26.16,63.5 LPC1.28
  Bottom 0.406: v61.72,44.2 v63.5,44.2 v68.33,44.2 72.14,44.2 v72.9,43.43 | v49.28,44.2 46.74,46.74 46.74,47.24 v49.05,49.55 | v52.58,24.13 49.78,26.92 49.78,39.62 50.55,40.39 50.55,41.4 51.05,41.91 v51.05,42.16
  Bottom 0.61: 17.5,15.21 J2.2 | 17.5,15.21 23.88,21.59 v23.88,26.92 | v4.32,39.37 v4.32,28.45 10.36,28.45 17.5,15.21
  Bottom 0.813: J1.4 17.47,85.94 25.91,82.8 25.91,66.55 26.42,66.04 LPC1.28 | 17.5,13.94 J2.2 | v14.48,39.62 v16.26,41.4 21.34,45.47 21.34,66.67 J4.4
+5V  (via drill 0.35)
  Top 0.305: R11.2 v50.32,51.1 R8.2 | R37.1 27.34,32.35 v26.43,33.26 26.42,33.27 | LED1.A 3.29,25.77 3.3,24.13 3.3,23.75 6.16,23.75 7.71,21.94 7.78,21.82 7.81,21.84 v11.18,21.84
  Top 0.406: J2.3 14,13.39
  Top 0.61: v27.69,82.04 v29.46,83.06 | v27.43,84.84 v24.64,81.79 | v24.64,55.12 22.21,52.81 18.39,50.88 12.27,50.88 D2.C D1.C | v44.96,55.88 31.75,55.88 v29.21,53.34
  Top 0.813: 14,13.39 19.3,18.85 v19.3,20.3
  Bottom 0.305: 23.1,33.26 23,33.36 | v11.18,21.84 11.18,15.82 J2.3
  Bottom 0.406: LPC1.2 29.16,40.69
  Bottom 0.61: v26.43,33.26 23.1,33.26 | v29.46,83.06 48.26,83.06 54.1,79.25 71.75,79.1 76.68,72.82 77.9,72.85 AUX2.10 | v50.32,51.1 50.29,51.18 45.97,55.88 v44.96,55.88 | v24.64,81.79 23.62,80.77 | v27.69,82.04 v27.43,84.84 | v24.64,55.12 27.18,55.12 28.96,53.34 | 28.96,53.34 LPC1.2 | v29.21,53.34 28.96,53.34
  Bottom 0.813: v19.3,20.3 19.28,30.1 23,33.36 29.16,39.52 29.16,40.69 | J1.3 14,85.57 15.49,84.07 17.78,84.07 18.29,83.57 22.57,81.82 23.62,80.77 24.64,79.76 v24.64,55.12
+12V  (via drill 0.35)
  Top 0.305: R10.2 R7.2 54.1,50.8 55.63,50.8 56.64,51.82 56.64,52.32 54.86,54.1 45.47,54.1 45.21,53.85 45.21,53.72 43.94,52.45 43.94,43.69 30.23,43.69 27.05,46.86 VR1.P3
  Top 0.813: v13.97,30.99 12.95,30.99 11.94,29.97 11.94,22.86 12.45,22.35 12.45,20.57 7.11,15.24 7.11,13.11 J2.5 | v22.86,48.77 24.89,48.77 VR1.P3
  Bottom 0.813: J1.1 7,85.71 10.16,81.79 17.53,81.79 22.86,78.49 v22.86,48.77 22.86,47.82 22.84,47.04 22.84,38.84 13.97,31.24 v13.97,30.99
ANI1
  Top 0.305: R40.1 88.39,27.94 87.12,26.67 87.12,21.59 87.97,20.74 R45.2 88.39,19.05 91.97,14.74 J5.2
ANI2
  Top 0.305: 85.48,20.74 R46.2 | 85.48,20.74 85.43,20.74 84.58,21.59 84.58,26.92 85.85,28.19 R42.1 | J5.3 88.47,14.91 85.85,18.8 85.85,20.37 85.48,20.74
ANI3
  Top 0.305: R43.1 83.31,28.7 82.04,27.43 82.04,21.59 82.89,20.74 R47.2 83.31,19.05 85.04,15.29 J5.4
ANI4
  Top 0.305: 80.67,20.74 R48.2 | 80.67,20.74 80.35,20.74 79.65,21.59 79.65,27.48 80.77,28.7 R44.1 | J5.5 81.52,15.36 80.77,19.05 80.77,20.64 80.67,20.74
DI1
  Top 0.305: OC1.8 72.26,18.16 72.24,15.24 74.27,13.24 J6.2
DI2
  Top 0.305: OC1.6 69.72,17.65 69.75,15.24 J6.3
DI3
  Top 0.305: OC1.4 67.18,16.13 67.21,13.99 67.44,13.44 J6.4
DI4
  Top 0.305: OC1.2 64.64,16.38 64.01,15.82 64.03,13.02 J6.5
DI5
  Top 0.305: 49.47,20.64 OC2.8 53.02,16.87 56.79,16.87 60.48,13.82 J7.1
DI6
  Top 0.305: J7.2 57,13.87 54.1,16.1 48.41,16.1 46.99,18.03 46.99,20.51 OC2.6
DI7
  Top 0.305: J7.3 53.47,14.05 52.38,15.29 46.99,15.29 44.45,18.03 44.45,20.51 OC2.4
DI8
  Top 0.305: J7.4 50.02,14.17 49.48,14.58 44.6,14.58 41.91,17.53 41.91,20.51 OC2.2
DO1
  Top 0.305: U1.16 26.67,82.75 J9.2
DO2
  Top 0.305: U1.15 27.94,80.52 J9.3
DO3
  Top 0.305: U1.14 29.26,79.86 30,80.52 30.4,80.9 33.15,83.31 34.13,83.31 J9.4
DO4
  Top 0.305: U1.13 30.56,79.78 33.55,82.42 37.36,82.4 41.46,86.11 42.53,87.06 J9.5
DO5
  Top 0.305: U1.12 31.75,79.73 33.96,81.69 37.89,81.69 42.01,85.45 44.31,85.45 J10.1
DO6
  Top 0.305: U1.11 33.02,79.81 34.16,80.95 38.25,80.95 42.39,84.84 47.1,84.84 J10.2
DO7
  Top 0.305: U1.10 34.34,79.83 34.9,80.21 38.65,80.16 42.8,84.18 49.96,84.2 J10.3
DO8
  Top 0.305: U2.16 41.15,79.2 43.46,82.93 63.28,82.88 J11.2
DO9
  Top 0.305: U2.15 42.39,78.84 44.58,82.27 66.06,82.27 J11.3
DO10
  Top 0.305: U2.14 43.69,78.92 45.47,81.64 68.93,81.64 J11.4
DO11
  Top 0.305: U2.13 44.93,78.82 46.35,80.95 72.15,80.95 J11.5
DO12
  Top 0.305: U2.12 46.18,78.87 47.17,80.31 75.35,80.26 J12.1
DO13
  Top 0.305: U2.11 47.47,78.51 48.11,79.6 78.71,79.58 J12.2
ERDN
  Top 0.305: LPC1.32 35.1,62.36 24.38,62.33 J4.6
ERDP
  Top 0.305: LPC1.33 38.84,63.75 37.19,62.1 35.76,62.1 35.31,61.65 23.96,61.65 20.2,64.41 19.37,64.44 18.49,65.3 18.54,65.28 18.09,65.68 16.81,65.68 15.92,66.44 15.92,67.39 17.27,68.51 J4.3
ETDN  (via drill 0.35)
  Top 0.305: v16.51,60.45 17.02,60.45 19.02,60.17 35.97,60.2 36.32,60.45 37.85,60.45 38.61,61.21 41.15,61.21 v41.4,60.96
  Bottom 0.305: J4.2 19.81,71.63 17.53,73.91 17.02,73.91 14.22,71.12 14.22,62.74 v16.51,60.45 | v41.4,60.96 41.4,63.5 LPC1.34
ETDP
  Top 0.305: LPC1.35 42.42,61.98 38.35,61.98 37.59,61.21 36.07,61.21 35.66,60.88 19.43,60.94 14.99,63.5 14.99,69.72 J4.1
GND  (via drill 0.35, 0.6)
  Top 0.305: C11.2 C12.2 42.93,30.48 44.45,28.96 44.45,27.24 OC2.13 44.32,25.92 44.33,25.15 | C11.2 C13.2 C14.2 | OC2.15 41.78,25.78 42.42,25.15 44.33,25.15 | 50.04,26.48 50.04,25.15 46.89,25.15 | 50.04,26.48 OC2.9 | 44.33,25.15 46.89,25.15 | OC2.11 46.86,25.17 46.89,25.15 | 67.31,25.15 69.82,25.15 | 67.31,25.15 65.28,25.15 64.64,25.78 OC1.15 64.64,29.5 C8.2 | 69.82,25.15 72.9,25.15 72.9,26.48 OC1.9 | OC1.11 69.72,25.24 69.82,25.15 | 67.31,25.15 67.18,25.27 OC1.13 67.18,28.87 68.69,30.37 | C8.2 C7.2 | C8.2 68.41,30.65 68.69,30.37 | 68.69,30.37 68.83,30.23 68.83,30.39 C10.2 C9.2 73.06,30.65 v73.15,30.73 | C22.2 60.36,49.44 61.21,50.29 65.1,50.29 | D5.1 C21.2 65.19,50.2 65.1,50.29 | D4.1 C20.2 70.02,50.13 69.85,50.29 | D3.1 C19.2 74.93,48.6 74.93,49.53 74.17,50.29 69.85,50.29 | 65.1,50.29 69.85,50.29 | 80.26,9.91 95.5,9.91 95.44,10.86 J5.1 95.42,14.31 91.44,18.54 91.44,20.49 C6.2 | 80.26,9.91 79.25,11.28 79.25,11.27 J6.1 | J2.4 10.58,16.59 | J7.5 46.52,12.9 46.52,11.31 46.53,9.88 80.26,9.91 | J9.1 28.56,88.63 30.4,90.47 58.98,90.47 59.03,90.53 59.26,90.53 60.55,89.23 60.55,88.18 J10.5 J11.1 64.85,88.14 67.46,90.75 92.35,90.75 92.63,90.47 92.63,88.74 93.23,88.14 | 93.23,88.14 J12.4 92.42,85.28 v92.46,73.15 | 93.23,88.14 J12.5 | U1.8 37.21,73.94 37.26,73.99 v37.82,74.5 | v52.05,77.95 U2.8 | v50.8,27.18 50.73,27.18 50.04,26.48 | C4.2 C3.2 | USB1.5 4.32,50.2 USB1.GND3 | C11.2 38.85,30.65 38.84,30.63 v38.84,30.66 | v30.56,30.63 30.56,31.5 31.37,32.31 32.22,32.31 C23.2 | C5.2 32.22,25.53 31.24,25.53 29.82,26.95 IC2.5 30.15,26.95 30.53,27.33 v30.61,27.33
  Top 0.406: v69.6,34.54 69.6,36.07 v72.64,39.12 | v73.41,46.48 74.68,46.48 D3.1 | 69.85,46.48 D4.1 | C22.2 60.45,48.51 60.45,46.74 60.71,46.48 60.45,46.23 D6.1 60.2,46.48 57.66,46.48 54.61,43.43 v51.31,43.43 | v47.75,46.99 47.24,47.5 46.48,47.5 C4.2
  Top 0.61: v24.65,47.23 v24.64,47.24 17.53,46.46 | C1.2 4.38,31.71 J3.SH2 2.11,31.54 v2.29,30.99 2.29,28.7 3.81,27.43 7.04,27.43 | 17.53,46.46 13.91,46.51 | 13.91,46.51 J3.CD2 10.84,45.34 J3.SH4 | 2.13,45.34 J3.SH1 2.26,45.15 v4.95,46.58 | v4.95,46.58 4.67,46.58 | 13.91,46.51 v4.95,46.58 | J3.6 3.54,41.67 v3.56,41.66 | 7.04,27.43 7.75,27.56 9.4,27.94 9.4,32.69 9.56,32.85 J3.SH3 | R1.1 7.11,26.09 7.04,27.43 | 17.53,46.46 C2.2
  Top 0.813: J1.2 10.67,86.83 10.67,86.36 14.1,82.93 J4.13 J4.14 12.91,59.56 12.17,58.83 6.83,58.83
  Bottom 0.305: v52.05,77.95 51.28,78.01 50.04,76.45 39.12,76.45 37.82,75.16 v37.82,74.5 28.56,82.74 J9.1 | v73.15,30.73 69.6,30.73 69.12,30.73 61.47,23.09 54.79,23.09 50.8,27.08 v50.8,27.18 | LPC1.54 v92.46,73.15 92.41,73.2 92.41,73.97 88.77,77.88 78.74,77.9 78.13,76.73 AUX2.9 | v38.84,30.66 30.53,30.66 | 30.43,30.66 30.53,30.66 | 30.53,30.66 v30.56,30.63 30.61,30.58 v30.61,27.33
  Bottom 0.406: v69.6,34.54 69.6,30.73 | v72.64,39.12 72.64,39.62 73.41,40.39 73.41,41.4 73.91,41.91 73.91,45.97 v73.41,46.48 | v47.75,46.99 v51.31,43.43
  Bottom 0.61: J1.2 10.47,88.96 12.39,91.29 19.76,91.29 20.07,90.68 20.32,90.68 21.08,89.92 21.08,88.25 J1.5 J9.1 | v24.64,47.24 24.6,47.24 24.64,47.21 | 2.29,41.69 v2.29,30.99 | 2.29,41.69 v4.95,46.58 | v3.56,41.66 2.32,41.66 2.29,41.69
  Bottom 0.813: VR1.P2 24.64,49.53 v24.64,47.24 24.64,47.21 24.64,42.67 LPC1.1
  other vias: 35.03,49.38 78.18,36.78 83.57,34.57 67.26,55.52 77.44,55.45 58.29,55.5 44.12,25.5 96.9,61.21 96.34,49.48
  pour Top (isolate 0.406): 0,99.82 100.08,99.82 100.33,100.08 100.33,0 0,0
  pour Bottom (isolate 0.406): 0.25,0 0.25,99.06 1.02,99.82 99.06,99.82 99.57,100.33 99.57,0.51 0.76,0.51
N$1
  Top 0.813: D2.A 25.22,51.64 VR1.P1
N$2
  Top 0.305: LED2.A 96.25,66.49 96.67,66.06 97.46,66.06 97.84,65.68 R3.2
N$3
  Top 0.305: LED3.A 96.25,56.35 96.57,56.03 97.56,56.03 97.81,55.78 97.81,55.03 R4.2
N$4
  Top 0.305: LED4.A 96.25,46.52 96.75,46.02 97.59,46.02 97.87,45.74 97.87,45.02 R5.2
N$5
  Top 0.305: LED5.A 96.25,36.39 96.65,35.99 97.51,35.99 97.81,35.69 97.81,34.93 R6.2
N$6
  Top 0.305: R1.2 5.31,24.68 LED1.C
N$9
  Top 0.305: U1.9 37.03,77.32 43.21,83.59 52.52,83.59 J10.4
N$13
  Top 0.305: U2.9 50.01,78.18 50.37,78.85 81.18,78.9 J12.3
N$15  (via drill 0.35)
  Top 0.305: R13.2 R15.2 75.27,22.35 74.17,22.35 73.66,22.86 62.23,22.86 61.56,22.19 R19.2 R17.2 v57.66,23.88 | C3.1 R9.1 R8.1 R7.1 54.44,52.07 v55.63,52.07
  Bottom 0.305: v57.66,23.88 57.66,36.58 55.63,38.86 v55.63,52.07
N$16
  Top 0.305: R20.1 40.36,20.49 OC2.1
N$31  (via drill 0.35)
  Top 0.305: R18.1 34.8,20.07 v36.07,18.8 | v42.97,18.8 42.97,20.05 OC2.3
  Bottom 0.305: v36.07,18.8 v42.97,18.8
N$32  (via drill 0.35)
  Top 0.305: OC2.5 45.59,18.92 v45.72,18.8 | v52.83,18.8 52.83,20.23 R16.1
  Bottom 0.305: v45.72,18.8 v52.83,18.8
N$33  (via drill 0.35)
  Top 0.305: OC2.7 48.13,19.94 50.29,18.03 v50.75,17.78 | v55.07,17.78 R14.1
  Bottom 0.305: v50.75,17.78 v55.07,17.78
N$38  (via drill 0.35)
  Top 0.305: R18.2 R20.2 37.34,22.35 v44.7,22.35 | R14.2 R16.2 52.58,22.61 v51.82,23.37 | 49.02,45.97 51.56,45.97 | 49.02,45.97 46.48,45.97 C4.1 v46.48,42.93 | 49.02,45.97 R12.1 | 51.56,45.97 54.1,45.97 R10.1 | 51.56,45.97 R11.1
  Bottom 0.305: v46.48,42.93 48.01,41.4 48.01,40.39 49.02,39.37 49.02,26.67 | 49.02,26.67 51.56,24.13 51.56,23.62 v51.82,23.37 | 49.02,26.67 v44.7,22.35
N$42
  Top 0.305: OC1.1 60.35,20.64 R19.1
N$43  (via drill 0.35)
  Top 0.254: R17.1 v57.66,18.8 | OC1.3 65.91,18.92 v65.79,18.8
  Bottom 0.254: v65.79,18.8 v57.66,18.8
N$44  (via drill 0.35)
  Top 0.305: v68.07,19.05 68.45,19.43 OC1.5 | v77.98,18.29 R15.1
  Bottom 0.305: v68.07,19.05 68.33,19.05 69.09,18.29 77.72,18.29 77.98,18.54 v77.98,18.29
N$49  (via drill 0.35)
  Top 0.305: OC1.7 70.99,19.43 v71.12,19.3 | v75.18,19.3 75.18,20.49 R13.1
  Bottom 0.305: v71.12,19.3 74.93,19.3 75.18,19.56 v75.18,19.3
N$66
  Top 0.305: OC1.16 63.22,27.27 R22.1 R30.2
N$67  (via drill 0.35)
  Top 0.305: R24.1 57.66,28.7 | 57.66,28.7 R31.2 | 57.66,28.7 58.42,28.7 58.67,28.96 v58.67,28.7 | v65.79,28.7 65.79,27.24 OC1.14
  Bottom 0.305: v58.67,28.7 v65.79,28.7 66.04,28.45
N$71
  Top 0.305: R29.1 R21.1 40.36,27.27 OC2.16
N$72  (via drill 0.35)
  Top 0.305: R34.1 R23.1 34.8,27.69 v35.98,28.86 36.07,28.96 | v42.16,28.7 42.67,28.7 42.93,28.45 42.93,27.24 OC2.14
  Bottom 0.305: v35.98,28.86 42,28.86 v42.16,28.7
N$73
  Top 0.305: 52.58,29.75 R25.1 | 52.58,29.75 R35.1 | OC2.12 45.59,28.07 48.41,29.41 52.1,29.41 52.58,29.75
N$74  (via drill 0.35)
  Top 0.305: 55.12,29.3 R27.1 | 55.12,29.3 R36.1 | OC2.10 48.64,28.32 v50.8,28.45 | v53.85,28.45 54.77,28.96 55.12,29.3
  Bottom 0.305: v50.8,28.45 v53.85,28.45
N$75
  Top 0.305: 75.44,30.55 R26.1 | 75.44,30.55 R32.2 | OC1.12 68.45,27.81 69.95,29.57 73.85,29.57 75.44,30.55
N$85
  Top 0.305: OC3.1 25.53,31.88 26.67,30.73 28.11,30.73 R37.2
N$86
  Top 0.305: R39.2 13.97,27.01 16.73,29.77 | 16.73,29.77 R38.2 | OC3.3 16.38,33.15 16.26,33.02 16.26,30.24 16.73,29.77
N$87
  Top 0.305: C15.1 R39.1 14.39,24.04 16.26,25.91 16.6,25.91 R41.2
N$88
  Top 0.305: C18.1 R41.1 | R41.1 16.93,24.04 | R41.1 17.28,24.04 18.09,23.24 19.21,23.24 IC1.3
N$89  (via drill 0.35)
  Top 0.305: 77.98,29.16 R28.1 | 77.98,29.16 77.98,30.39 R33.2 | OC1.10 70.99,27.56 v71.88,28.7 | v76.96,28.7 77.42,28.7 77.98,29.16
  Bottom 0.305: v71.88,28.7 v76.96,28.7
P0.0  (via drill 0.35)
  Top 0.305: v25.65,22.86 25.65,20.83 IC2.1 | v25.15,28.96 25.4,28.96 25.91,29.46 28.7,29.46 29.21,29.97 29.21,31.24 33.53,35.56 41.4,35.56 LPC1.9
  Bottom 0.305: v25.65,22.86 25.68,23.9 25.68,26.87 v25.15,28.96
P0.1  (via drill 0.35)
  Top 0.305: IC2.4 29.21,20.83 29.46,21.08 29.72,20.83 29.97,20.83 31.24,19.56 v31.24,19.3 | v48.01,39.12 49.28,40.39 LPC1.10
  Bottom 0.305: v31.24,19.3 34.04,19.3 48.26,33.53 48.26,38.86 v48.01,39.12
P0.2
  Bottom 0.305: AUX3.2 67.11,72.64 70.92,70.61 70.92,58.09 75.59,51.21 75.59,42.52 LPC1.21
P0.3
  Bottom 0.305: LPC1.22 79.05,40.89 76.3,43.64 76.3,51.46 73.3,56.92 73.48,72.44 AUX3.1
P0.4
  Top 0.305: U1.1 26.67,68.33 29.46,65.53 50.04,65.53 LPC1.38
P0.5
  Top 0.305: U1.2 27.94,67.87 29.72,66.09 52.02,66.09 LPC1.39
P0.6
  Top 0.305: J3.2 3.12,37.27 | 3.12,37.27 7.11,33.27 R2.1 | 3.12,37.27 4.64,37.27 5.59,36.32 41.15,36.32 44.2,39.37 LPC1.8
P0.7
  Top 0.305: J3.5 23.55,40.57 25.91,42.93 41.4,42.93 41.66,42.67 LPC1.7
P0.8  (via drill 0.35)
  Top 0.305: J3.7 3.46,42.77 3.56,42.67 v5.84,42.67 | v5.84,37.34 36.07,37.34 39.12,40.39 LPC1.6
  Bottom 0.305: v5.84,42.67 v5.84,37.34
P0.9
  Top 0.305: J3.3 8.87,38.37 12.95,38.35 34.8,38.35 36.58,40.13 LPC1.5
P0.10
  Top 0.305: U1.3 29.21,67.41 29.97,66.65 54,66.65 LPC1.40
P0.11
  Top 0.305: U1.4 30.48,68.07 31.29,67.21 55.98,67.21 LPC1.41
P0.15
  Bottom 0.305: LPC1.13 59.64,45.62 59.64,45.74 60.6,47.27 60.6,59.03 63.25,61.09 63.25,66.45 58.19,70.41 58.19,75.34 AUX3.7
P0.16
  Bottom 0.305: LPC1.14 61.72,46.61 61.72,58.3 61.87,58.45 65.93,61.07 65.79,67.44 61.21,70.87 59.49,72.44 AUX3.8
P0.17
  Bottom 0.406: AUX3.5 61.04,77.09 60.45,77.6 56.01,77.65 54.58,74.7 54.61,72.64 54.61,66.29 55.63,65.28 55.63,53.59 54.36,52.32 LPC1.12
P0.18
  Bottom 0.406: LPC1.11 52.25,41.33 52.25,44.95 53.15,45.84 53.15,74.91 55.12,78.33 62.26,78.26 63.22,77.09 63.25,74.83 62.23,73.68 AUX3.6
P0.21  (via drill 0.35)
  Top 0.305: IC2.2 IC2.3 28.19,20.57 28.04,20.57 28.07,19.36 29.46,18.29 v31.24,18.29
  Bottom 0.305: v31.24,18.29 34.04,18.29 37.08,21.34 60.71,21.34 63.5,24.13 87.88,24.13 88.14,23.88 88.65,23.88 89.41,24.64 89.41,33.02 82.3,40.13 LPC1.23
P0.23  (via drill 0.35)
  Top 0.305: R48.1 v80.77,25.15 | LPC1.15 61.98,42.42 62.57,43.01 D6.3 62.57,48.01 C22.1
  Bottom 0.305: v80.77,25.15 80.77,26.92 72.14,35.56 67.31,35.56 LPC1.15
P0.24  (via drill 0.35)
  Top 0.305: R47.1 v83.31,25.15 | LPC1.16 64.52,42.42 65.02,42.93 66.04,42.93 67.39,44.28 D5.3 67.39,48.01 C21.1
  Bottom 0.305: v83.31,25.15 83.31,25.4 72.14,36.58 67.56,36.58 64.52,39.62 LPC1.16
P0.25  (via drill 0.35)
  Top 0.305: R46.1 v85.85,25 85.85,25.15 | LPC1.17 67.06,42.42 67.67,42.82 71.32,42.82 72.22,44.03 D4.3 72.22,48.01 C20.1
  Bottom 0.305: v85.85,25 84.72,25 72.14,37.59 68.33,37.59 67.06,38.86 LPC1.17
P0.26  (via drill 0.35)
  Top 0.305: R45.1 v88.39,24.89 | LPC1.18 69.6,41.66 70.1,42.16 76.71,42.16 77.05,42.5 D3.3 77.05,48.01 C19.1
  Bottom 0.305: v88.39,24.89 87.38,24.89 86.41,25.91 84.84,25.91 72.39,38.35 70.36,38.35 69.6,39.12 LPC1.18
P1.18
  Top 0.305: R3.1 96.14,64.99 96.14,63.48 92.46,59.79 LPC1.73
P1.19
  Top 0.305: LPC1.72 90.91,56.24 91.52,55.78 95.37,55.78 R4.1
P1.20
  Top 0.305: LPC1.71 87.35,57.06 88.54,55.7 88.54,54.06 89.2,53.16 94.21,53.16 95.02,52.35 95.02,46.13 R5.1
P1.21  (via drill 0.35)
  Top 0.305: LPC1.70 94.18,54.53 95.68,53.03 97.79,53.03 97.81,53.01 97.81,52.96 v97.79,52.93 | v93.6,35.76 94.88,35.76 R6.1
  Bottom 0.305: v97.79,52.93 97.79,41.48 93.52,37.21 93.52,35.84 v93.6,35.76
P1.22
  Bottom 0.305: LPC1.69 89.76,54.53 88.52,55.78 86.33,55.78 85.6,56.52 85.6,60.2 83.49,62.31 83.49,70.59 AUX2.4
P1.23  (via drill 0.35)
  Top 0.305: C10.1 68.58,32.51 69.85,33.78 77.72,33.78 78.04,33.47 | 78.04,33.47 78.23,33.27 R33.1 | v92.08,42.93 93.73,42.93 93.73,50.32 93.24,50.72 88.95,50.72 88.65,50.98 88.65,52.6 | v85.98,37.59 85.72,37.85 82.42,37.85 78.04,33.47 | 88.65,52.63 88.65,52.6 | 88.65,52.6 87.68,54 87.38,54.3 LPC1.68
  Bottom 0.305: v92.08,42.93 91.44,42.42 89.79,42.42 88.65,41.27 88.65,40.51 85.98,37.85 v85.98,37.59
P1.24  (via drill 0.35)
  Top 0.305: C9.1 72.52,32.35 | 72.52,32.35 R32.1 | 94.17,41.97 94.36,42.55 94.36,51.31 92.46,52.02 LPC1.67 | 94.17,41.97 93.98,41.66 | v71.88,34.67 75.69,38.48 88.9,38.48 89.41,38.23 92.33,38.23 93.09,39.88 93.98,40.77 93.98,41.66 | v72.52,32.38 72.52,32.35 | 93.98,41.66 93.98,41.78 94.17,41.97
  Bottom 0.305: v71.88,34.67 71.88,33.02 v72.52,32.38
P1.25  (via drill 0.35)
  Top 0.305: C8.1 64.6,33.78 58.42,33.78 57.66,33.02 R31.1 57.78,32.26 58.93,31.11 58.93,29.59 59.56,28.96 59.56,28.32 59.05,27.81 v59.05,27.69 | v61.98,24.77 62.23,24.77 63.5,23.5 74.3,23.5 74.55,23.75 76.33,23.75 v76.83,23.24 | v90.04,39.24 90.04,39.12 88.67,40.44 88.67,41.27 88.52,41.53 v88.52,42.34
  Bottom 0.305: v61.98,24.77 v59.05,27.69 | v76.83,23.24 77.09,23.5 87.63,23.5 87.88,23.24 88.9,23.24 90.04,24.38 v90.04,39.24 | v88.52,42.34 88.52,44.96 88.65,45.21 88.65,48.92 88.67,50.01 88.67,50.24 88.65,51.18 89.92,52.45 LPC1.66
P1.26  (via drill 0.35)
  Top 0.305: R30.1 61.34,32.35 | 61.34,32.35 C7.1 | v60.71,34.67 60.68,38 58.17,40.51 58.17,41.27 57.4,42.04 57.4,43.43 v57.28,43.56 | v61.34,32.38 61.34,32.35 | v59.82,51.94 60.07,51.94 60.45,52.32 72.39,52.32 72.9,52.83 76.07,52.83 77.47,51.44 86.54,51.44 87.38,51.87 LPC1.65
  Bottom 0.305: v60.71,34.67 60.71,33.02 v61.34,32.38 | v57.28,43.56 57.28,44.83 59.94,47.5 59.94,51.82 v59.82,51.94
P1.27  (via drill 0.35)
  Top 0.305: AUX2.5 82.98,75.59 84.23,74.6 84.28,72.44 91.16,64.82 v91.16,57.73
  Bottom 0.305: LPC1.64 92.46,49.48 91.24,50.7 91.24,52.96 91.16,53.09 v91.16,57.73
P1.28  (via drill 0.35)
  Top 0.305: 47.31,33.59 48.01,34.29 50.67,34.29 51.31,33.66 54.61,33.66 55.12,33.15 R36.2 | 47.31,33.59 46.1,32.38 45.72,32.38 C14.1 | v46.1,34.8 47.31,33.59 | v45.21,54.86 48.13,57.53 76.83,57.53 v81.66,55.3 | v81.79,48.21 86.44,48.21 88.06,48.18 88.75,48.16 89.15,48.18 LPC1.63
  Bottom 0.305: v46.1,34.8 46.1,39.88 45.47,40.51 45.47,41.27 45.21,41.53 v45.21,54.86 | v81.79,48.21 v81.66,55.3
P1.29  (via drill 0.35)
  Top 0.305: C13.1 51.44,32.35 | 51.44,32.35 R35.2 | v52.2,38.23 52.2,38.86 50.55,40.51 50.55,41.27 v47.37,44.45 | v51.44,32.38 51.44,32.35 | v52.2,54.99 52.45,54.74 55.12,54.74 56.9,52.96 72.14,52.96 72.64,53.47 v77.72,53.47 | v77.75,50.42 86.03,50.47 LPC1.62
  Bottom 0.305: v52.2,38.23 52.07,37.21 52.07,34.29 51.69,34.04 51.69,32.64 v51.44,32.38 | v47.37,44.45 47.4,45.03 45.97,46.48 45.97,47.83 48.46,50.47 49.84,50.44 51.31,48.39 51.82,48.39 52.45,49.02 52.45,54.74 v52.2,54.99 | v77.75,50.42 v77.72,53.47
P1.30  (via drill 0.35)
  Top 0.305: LPC1.19 72.39,40.89 73.99,39.29 80.7,39.29 81.03,39.62 v81.03,39.6 | v83.03,56.41 83.03,59.26 v85.85,62.08 85.95,62.18
  Bottom 0.305: v81.03,39.6 81.03,44.55 83.08,46.61 83.08,56.44 83.06,56.44 v83.03,56.41 | AUX2.1 88.09,75.36 86.92,74.35 86.97,66.19 86.16,65.3 86.18,62.48 v85.85,62.08
P1.31  (via drill 0.35)
  Top 0.305: R34.2 34.8,33.27 35.56,34.04 41.91,34.04 42.74,33.21 | 42.74,33.21 42.93,33.02 C12.1 | v73.15,51.94 72.9,51.69 60.71,51.69 56.77,47.75 v56.52,47.75 | v56.52,42.29 55.63,41.53 55.63,39.98 53.49,36.07 46.25,36.07 43.31,33.78 42.74,33.21
  Bottom 0.305: v73.15,51.94 74.93,50.16 74.93,41.15 LPC1.20 | v56.52,47.75 56.26,47.5 56.26,42.55 v56.52,42.29
P2.0
  Top 0.305: U1.5 31.75,68.33 32.31,67.77 57.96,67.77 LPC1.42
P2.1
  Top 0.305: U1.6 33.02,68.83 33.53,68.33 59.94,68.33 LPC1.43
P2.2
  Top 0.305: U1.7 34.29,69.6 35,68.89 61.92,68.89 LPC1.44
P2.3
  Top 0.305: U2.1 41.12,70.54 43.08,69.44 63.91,69.44 LPC1.45
P2.4
  Top 0.305: U2.2 42.37,70.97 43.64,70.05 65.89,70 LPC1.46
P2.5  (via drill 0.35)
  Top 0.305: v51.82,61.47 72.39,61.47 LPC1.47 | U2.7 v48.59,74.32
  Bottom 0.305: v51.82,61.47 51.05,61.47 50.56,62.09 50.54,67.44 50.52,69.16 v48.59,74.32
P2.6  (via drill 0.35)
  Top 0.305: v50.04,60.45 74.42,60.45 LPC1.48 | U2.6 v47.45,74.33
  Bottom 0.305: v47.45,74.33 48.08,67.78 48.1,61.95 49.67,60.56 v50.04,60.45
P2.7  (via drill 0.35)
  Top 0.305: v48.51,59.44 75.69,59.44 LPC1.49 | U2.5 v46.2,74.35
  Bottom 0.305: v46.2,74.35 45.47,66.41 45.48,64.49 45.48,61.45 v48.51,59.44
P2.8  (via drill 0.35)
  Top 0.305: v46.99,58.42 77.22,58.42 LPC1.50 | U2.4 v44.96,74.35
  Bottom 0.305: v44.96,74.35 43.31,66.03 42.82,64.49 42.82,62.34 44.83,59.94 v46.99,58.42
P2.11
  Top 0.305: LPC1.52 86.49,65.08 85.83,66.04 71.67,66.04 67.15,70.56 67.06,70.61 44.25,70.66 43.69,71.3 U2.3
P2.12
  Top 0.305: AUX2.6 82.96,70.87 89.89,63.75 LPC1.53
P2.13  (via drill 0.35)
  Top 0.305: v47.24,34.92 v51.18,34.92 | LPC1.27 89.97,43.1 86.67,43.1 86.08,42.93 83.74,42.93 82.55,44.2 75.69,51.05 60.96,51.05 54.1,44.2 53.59,44.2 v53.34,44.45 | R29.2 37.34,32.38 40.13,32.38 C11.1 40.26,32.38 41.02,32.38 v41.66,33.02
  Bottom 0.305: v53.34,44.45 53.59,44.2 53.59,41.91 53.09,41.4 53.09,40.39 50.55,37.85 50.55,34.92 v51.18,34.92 | v41.66,33.02 45.97,33.02 v47.24,34.92
P4.28
  Bottom 0.305: LPC1.59 85.37,46.91 84.33,47.95 84.33,56.79 81.03,60.1 81.03,69.77 79.3,71.5 79.3,74.65 AUX2.7
P4.29
  Bottom 0.305: 96.34,51.28 94.06,48.87 93.93,45.52 92.76,44.6 LPC1.58 | 96.34,51.28 96.39,51.33 | 96.34,51.28 96.34,57.51 91.19,62.66 91.19,69.95 AUX2.2
PWMA  (via drill 0.35)
  Top 0.305: OC3.2 24.51,33.15 v26.42,35.05 | v32,75.44 48.01,75.44 48.74,76.12 U2.10
  Bottom 0.305: v26.42,35.05 26.42,35.31 30.23,39.12 30.23,73.66 31.75,75.44 v32,75.44
RESET  (via drill 0.35)
  Top 0.305: v52.83,75.95 57.91,78.23 82.91,78.23 AUX2.3
  Bottom 0.305: 33.02,64.52 33.02,66.29 40.39,75.44 51.05,75.44 v52.83,75.95 | 32.77,63.25 31.5,61.21 31.5,43.94 LPC1.4
  Bottom 0.406: 33.02,64.52 32.77,64.26 32.77,63.25
RS485A
  Top 0.305: IC2.6 28.07,25.78 28.96,24.89 30.48,24.89 32.26,23.11 R49.1 32.35,22.1 33.02,22.1 33.53,21.59 33.53,18.54 34.29,17.78 39.12,17.78 42.76,13.32 J8.1
RS485B
  Top 0.305: IC2.7 26.8,26.04 28.96,23.88 30.48,23.88 30.99,23.37 30.99,21.76 R49.2 32.26,18.29 33.78,16.76 36.32,16.76 39.31,13.52 J8.2
SGND
  Top 0.305: C15.2 C18.2 17.36,20.57 18.03,20.57 18.03,21.59 18.11,21.67 19.84,21.67 20.55,20.95 | 19.7,29.55 C16.2 | 19.7,29.55 C17.2 | J8.5 25.73,13 20.55,18.19 20.55,20.95 | 19.7,29.55 19.68,29.57 18.47,29.57 17.01,28.11 R38.1 16.76,27.81 18.01,26.57 18.01,24.77 18.69,24.08 19.22,24.08 IC1.2 19.29,24.16 20.17,24.16 20.55,23.75 20.55,20.95
SIN
  Top 0.305: C16.1 C17.1 | C17.1 21.88,27.63 IC1.5 21.98,25.08 23.06,24 23.06,18.29 25.4,15.75 34.29,15.75 36.02,13.72 J8.3 | C17.1 22.52,27.85 24.38,29.21 24.38,30.99 20.32,30.99 19.56,31.75 17.71,31.75 OC3.4
SOUT
  Top 0.305: J8.4 32.46,13.56 30.73,14.99 24.89,14.99 21.89,17.98 21.88,18.07 IC1.4 20.8,24.43 20.8,24.79 20.51,25.08 IC1.1
UDM
  Top 0.305: LPC1.36 43.23,57.2 26.95,57.45 23.75,57.3 23.64,57.4 11.94,57.4 7.08,52.72 USB1.2
UDP
  Top 0.305: LPC1.37 44.7,56.64 11.95,56.64 | 11.95,56.64 11.94,56.64 | USB1.3 7.48,52.15 11.95,56.64
VUSB  (via drill 0.35)
  Top 0.406: USB1.1 5.42,53.37 v7.04,54.99 7.09,55.04
  Top 0.61: D1.A 17.2,53.77 v18.39,54.97
  Bottom 0.406: v7.04,54.99 18.36,54.99 v18.39,54.97

### Text on the board
tPlace: +VIN | GND | +5V | +3V3 | GND | GND | DO1 | DO2 | DO3 | DO4 | DO5 | DO6 | DO7 | COMA | GND | GND | DO8 | DO9 | DO10 | DO11 | DO12 | DO13 | COMB | GND | GND | lpcCNC | Rev0.2 Sept 2017 | VIN | DIN | 3.3V | 5V | 1-4 | 5-8 | SIN | GND | +5V | GND | RSB | RSA | GND | GND | GND | +VIN | +3V3 | SGND | SOUT | DIN8 | DIN7 | DIN6 | DIN5 | DIN4 | DIN3 | DIN2 | DIN1 | AIN4 | AIN3 | AIN2 | AIN1
bPlace: lpcCNC lpc1769 CNC Controller | richard.ibbotson@ribbotson.com